# Altium project B100.PrjPcb (part 2 of 7)

## Sheet 3V3 LDO Regulator.SchDoc: 3V3 LDO Regulator
size A4; ApprovedBy: Mehmet Günce Akkoyun; CheckedBy: Mehmet Günce Akkoyun; Author: Mehmet Günce Akkoyun; CompanyName: Ovoo Electronics; DrawnBy: Mehmet Günce Akkoyun; Engineer: Mehmet Günce Akkoyun; Organization: Ovoo Electronics; Address1: Necip Fazıl Mah. Ortaırmak Sok.; Address2: Birgül Apt. No: 19/6; Address3: Meram / Konya; Address4: Turkiye; DocumentNumber: 5; Revision: R06; SheetNumber: 5; SheetTotal: 54
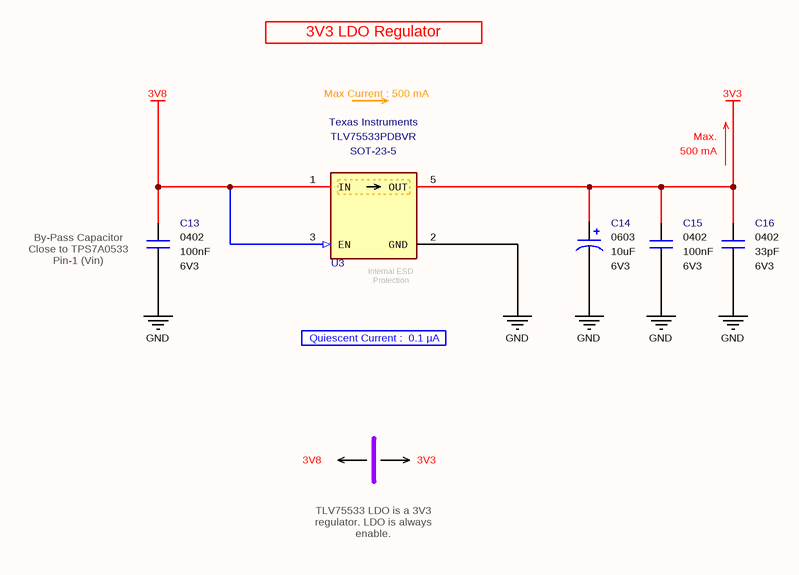
[diagram p6: 3V3 LDO Regulator.SchDoc]

### Parts
C13  value 100nF  Case: 0402  Voltage: 6V3  [CAPACITOR_0402]  (hidden comment: Multilayer Ceramic Capacitor)
C14  value 10uF  Case: 0603  Voltage: 6V3  [CAPACITOR_0603 - TANTALUM]  (hidden comment: Tantalum Capacitor)
C15  value 100nF  Case: 0402  Voltage: 6V3  [CAPACITOR_0402]  (hidden comment: Multilayer Ceramic Capacitor)
C16  value 33pF  Case: 0402  Voltage: 6V3  [CAPACITOR_0402]  (hidden comment: Multilayer Ceramic Capacitor)
U3  Manufacturer Part Number: TLV75533PDBVR  Manufacturer Name: Texas Instruments  [SOT-23-5]  (hidden comment: LDO Voltage Regulator)

### Nets
3V3: C14.1 C15.2 C16.1 U3.5(OUT)
3V8: C13.1 U3.1(IN) U3.3(EN)
GND: C13.2 C14.2 C15.1 C16.2 U3.2(GND)

Not connected (* = marked no-connect by the designer): U3 4(NC)

### Notes on the sheet
- 3V3 LDO Regulator
- Max Current : 500 mA
- Max.
- 500 mA
- (near C13) By-Pass Capacitor
  Close to TPS7A0533
  Pin-1 (Vin)
- Quiescent Current :  0.1 µA
- (near U3) Internal ESD Protection
- 3V8
- 3V3
- TLV75533 LDO is a 3V3 regulator. LDO is always enable.
- Title
- Size:
- Date:
- A4
- Number:
- Time:
- Revision:
- Sheet
- of
- File:

### Library data of the parts
C13 C15 = Capacitor - 100nF [0402-6V3]: Capacitor - 100nF [0402-6V3] (Ceramic); Manufacturer Name: AVX; Manufacturer Part Number: 04026D104KAT4A; Dielectric: X5R; Tolerance: %10; Height: 0.25mm; ComponentLink1Description: Mouser; ComponentLink1URL: https://www.mouser.com.tr/ProductDetail/AVX/04026D104KAT4A?qs=sGAEpiMZZMs0AnBnWHyRQPg4iYkCw7IMED%2F4kpqgf7w%3D; ComponentLink2Description: DataSheet; ComponentLink2URL: https://www.mouser.com.tr/datasheet/2/40/cx5r-776519.pdf; ROHS: Yes; Maximum Operating Temperature: +85; Minimum Operating Temperature: -55; Supplier 1: Avnet; Supplier Part Number 1: 04026D104KAT4A; Mouser Part Number: 581-04026D104KAT4A
C14 = Capacitor - 10uF [0603-6V3] (Tantalium): Capacitor - 10uF [0603] (Tantalium); Manufacturer Name: AVX; Manufacturer Part Number: F380J106MMAAH3; ESR: 200 mOhms; Leakage Current: 10uA; Tolerance: 20%; Height: 0.8mm; Maximum Operating Temperature: +105; Minimum Operating Temperature: -55; ROHS: Yes; ComponentLink1Description: DataSheet; ComponentLink1URL: https://www.mouser.com.tr/datasheet/2/40/f38-775706.pdf; ComponentLink2Description: Mouser; ComponentLink2URL: https://www.mouser.com.tr/ProductDetail/AVX/F380J106MMAAH3?qs=sGAEpiMZZMtZ1n0r9vR22fixilZl6Mr8zRKleESmvcDFwZ4LSyC6Pg%3D%3D; Supplier 1: Mouser; Supplier 2: Digi-Key; Supplier Part Number 2: 478-12031-1-ND; Supplier Part Number 1: 581-F380J106MMAAH3; Mouser Part Number: 581-F380J106MMAAH3
C16 = Capacitor - 33pF [0402-6V3]: as C222 on sheet 3V8 Buck Boost Converter; Height: 0.5mm; Maximum Operating Temperature: +125; Minimum Operating Temperature: -55; ROHS: Yes; ComponentLink1Description: DataSheet; ComponentLink1URL: https://api.kemet.com/component-edge/download/datasheet/C0402C330J9RACAUTO.pdf; ComponentLink2Description: Mouser; ComponentLink2URL: https://www.mouser.com/Search/Refine.aspx?Keyword=80-C0402C330J9RAUTO; Supplier 1: Mouser; Supplier Part Number 1: 80-C0402C330J9RAUTO; Mouser Part Number: 80-C0402C330J9RAUTO
U3 = IC - TLV75533PDBVR: LDO Voltage Regulators 500-mA low-IQ small-size low-dropout (LDO) regulator.; Output Current: 500 mA; Output Voltage: 3.3 V; Dropout Voltage - Max: 220 mV at 500 mA; Height: 1.45mm; ComponentLink1Description: DataSheet; ComponentLink1URL: https://www.ti.com/lit/ds/symlink/tlv755p.pdf?HQS=dis-mous-null-mousermode-dsf-pf-null-wwe&DCM=yes&ref_url=https%3A%2F%2Fwww.mouser.de%2F&distId=26; ComponentLink2Description: Mouser; ComponentLink2URL: https://www.mouser.com.tr/ProductDetail/Texas-Instruments/TLV75533PDBVR/?qs=55YtniHzbhAKEwqeO2xJXQ%3D%3D; Minimum Operating Temperature: -40; Maximum Operating Temperature: +125; Supplier 1: Mouser; Supplier 2: Arrow Electronics; Supplier 3: Digi-Key; Supplier 4: Digi-Key; Supplier 5: Digi-Key; Supplier 6: Avnet; Supplier Part Number 1: 595-TLV75533PDBVR; Supplier Part Number 2: TLV75533PDBVR; Supplier Part Number 3: 296-50411-1-ND; Supplier Part Number 4: 296-50411-6-ND; Supplier Part Number 5: 296-50411-2-ND; Supplier Part Number 6: TLV75533PDBVR; Case: SOT-23-5; Mouser Part Number: 595-TLV75533PDBVR

## Sheet GSM IoT.SchDoc: GSM IoT Block Diagram
size A3; ApprovedBy: Mehmet Günce Akkoyun; CheckedBy: Mehmet Günce Akkoyun; Author: Mehmet Günce Akkoyun; CompanyName: Ovoo Electronics; DrawnBy: Mehmet Günce Akkoyun; Engineer: Mehmet Günce Akkoyun; Organization: Ovoo Electronics; Address1: Necip Fazıl Mah. Ortaırmak Sok.; Address2: Birgül Apt. No: 19/6; Address3: Meram / Konya; Address4: Turkiye; DocumentNumber: 8; Revision: R06; SheetNumber: 8; SheetTotal: 54
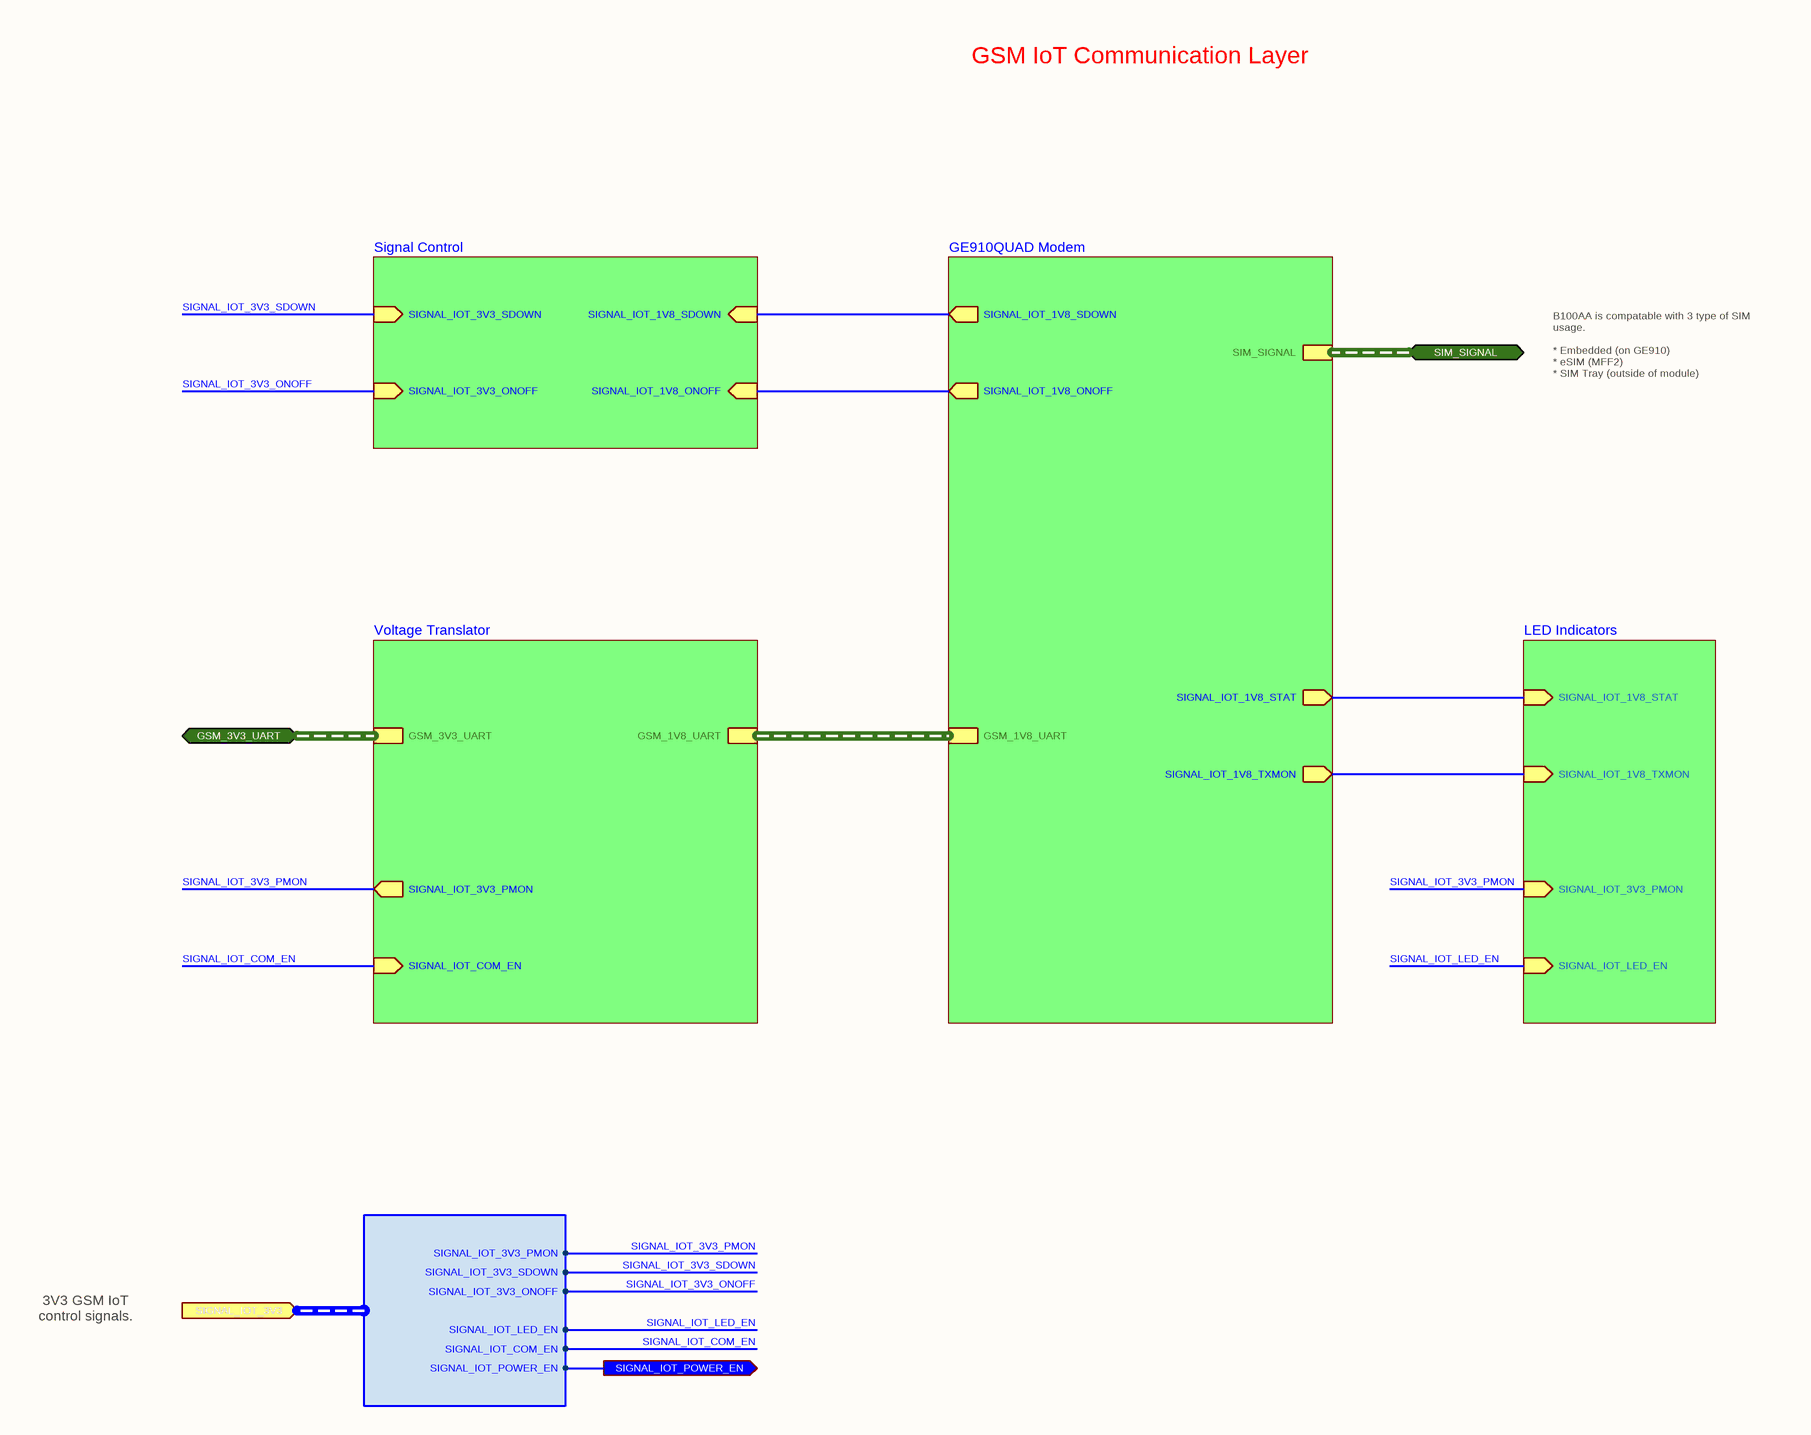
[diagram p7: GSM IoT.SchDoc]

### Sub-sheets
GE910QUAD Modem = GE910QUAD Modem.SchDoc: SIGNAL_IOT_1V8_STAT (out), SIGNAL_IOT_1V8_TXMON (out), SIGNAL_IOT_1V8_ONOFF (out), GSM_1V8_UART (harness GSM_1V8_UART), SIGNAL_IOT_1V8_SDOWN (out), SIM_SIGNAL (harness SIM_SIGNAL)
LED Indicators = GSM LED Indicators.SchDoc: SIGNAL_IOT_3V3_PMON (in), SIGNAL_IOT_1V8_STAT (in), SIGNAL_IOT_LED_EN (in), SIGNAL_IOT_1V8_TXMON (in)
Signal Control = GSM Signal Control.SchDoc: SIGNAL_IOT_3V3_SDOWN (in), SIGNAL_IOT_3V3_ONOFF (in), SIGNAL_IOT_1V8_SDOWN (in), SIGNAL_IOT_1V8_ONOFF (in)
Voltage Translator = Bidirectional Voltage Translator.SchDoc: GSM_3V3_UART (harness GSM_3V3_UART), SIGNAL_IOT_COM_EN (in), GSM_1V8_UART (harness GSM_1V8_UART), SIGNAL_IOT_3V3_PMON (out)

### Ports
GSM_3V3_UART (bidir, harness GSM_3V3_UART), SIGNAL_IOT_3V3 (in, harness SIGNAL_IOT_3V3), SIGNAL_IOT_POWER_EN (out), SIM_SIGNAL (bidir, harness SIM_SIGNAL)

### Harnesses
SIGNAL_IOT_3V3: SIGNAL_IOT_COM_EN, SIGNAL_IOT_POWER_EN, SIGNAL_IOT_LED_EN, SIGNAL_IOT_3V3_SDOWN, SIGNAL_IOT_3V3_ONOFF, SIGNAL_IOT_3V3_PMON

### Nets
SIGNAL_IOT_3V3.SIGNAL_IOT_POWER_EN: port SIGNAL_IOT_POWER_EN, port SIGNAL_IOT_3V3.SIGNAL_IOT_POWER_EN
SIGNAL_IOT_3V3_ONOFF: sheet Signal Control/SIGNAL_IOT_3V3_ONOFF, port SIGNAL_IOT_3V3.SIGNAL_IOT_3V3_ONOFF  [project net SIGNAL_IOT_3V3.SIGNAL_IOT_3V3_ONOFF]
SIGNAL_IOT_3V3_PMON: sheet Voltage Translator/SIGNAL_IOT_3V3_PMON, sheet LED Indicators/SIGNAL_IOT_3V3_PMON, port SIGNAL_IOT_3V3.SIGNAL_IOT_3V3_PMON  [project net SIGNAL_IOT_3V3.SIGNAL_IOT_3V3_PMON]
SIGNAL_IOT_3V3_SDOWN: sheet Signal Control/SIGNAL_IOT_3V3_SDOWN, port SIGNAL_IOT_3V3.SIGNAL_IOT_3V3_SDOWN  [project net SIGNAL_IOT_3V3.SIGNAL_IOT_3V3_SDOWN]
SIGNAL_IOT_COM_EN: sheet Voltage Translator/SIGNAL_IOT_COM_EN, port SIGNAL_IOT_3V3.SIGNAL_IOT_COM_EN  [project net SIGNAL_IOT_3V3.SIGNAL_IOT_COM_EN]
SIGNAL_IOT_LED_EN: sheet LED Indicators/SIGNAL_IOT_LED_EN, port SIGNAL_IOT_3V3.SIGNAL_IOT_LED_EN  [project net SIGNAL_IOT_3V3.SIGNAL_IOT_LED_EN]
NetQ1_3: sheet GE910QUAD Modem/SIGNAL_IOT_1V8_ONOFF, sheet Signal Control/SIGNAL_IOT_1V8_ONOFF
NetQ2_3: sheet GE910QUAD Modem/SIGNAL_IOT_1V8_SDOWN, sheet Signal Control/SIGNAL_IOT_1V8_SDOWN
NetR23_2: sheet GE910QUAD Modem/SIGNAL_IOT_1V8_STAT, sheet LED Indicators/SIGNAL_IOT_1V8_STAT
NetR24_2: sheet GE910QUAD Modem/SIGNAL_IOT_1V8_TXMON, sheet LED Indicators/SIGNAL_IOT_1V8_TXMON

### Buses and harness runs
harness port GSM_3V3_UART = sheet Voltage Translator/GSM_3V3_UART
harness port SIM_SIGNAL = sheet GE910QUAD Modem/SIM_SIGNAL
harness sheet GE910QUAD Modem/GSM_1V8_UART = sheet Voltage Translator/GSM_1V8_UART

### Notes on the sheet
- GSM IoT Communication Layer
- B100AA is compatable with 3 type of SIM usage.
  * Embedded (on GE910)
  * eSIM (MFF2)
  * SIM Tray (outside of module)
  One of these SIM type is used.
- 3V3 GSM IoT control signals.
- Title
- Size:
- Date:
- A3
- Number:
- Time:
- Revision:
- Sheet
- of
- File:

## Sheet GE910QUAD Modem.SchDoc: GE910 GSM Modem & SIM
size A3; ApprovedBy: Mehmet Günce Akkoyun; CheckedBy: Mehmet Günce Akkoyun; Author: Mehmet Günce Akkoyun; CompanyName: Ovoo Electronics; DrawnBy: Mehmet Günce Akkoyun; Engineer: Mehmet Günce Akkoyun; Organization: Ovoo Electronics; Address1: Necip Fazıl Mah. Ortaırmak Sok.; Address2: Birgül Apt. No: 19/6; Address3: Meram / Konya; Address4: Turkiye; DocumentNumber: 9; Revision: R06; SheetNumber: 9; SheetTotal: 54
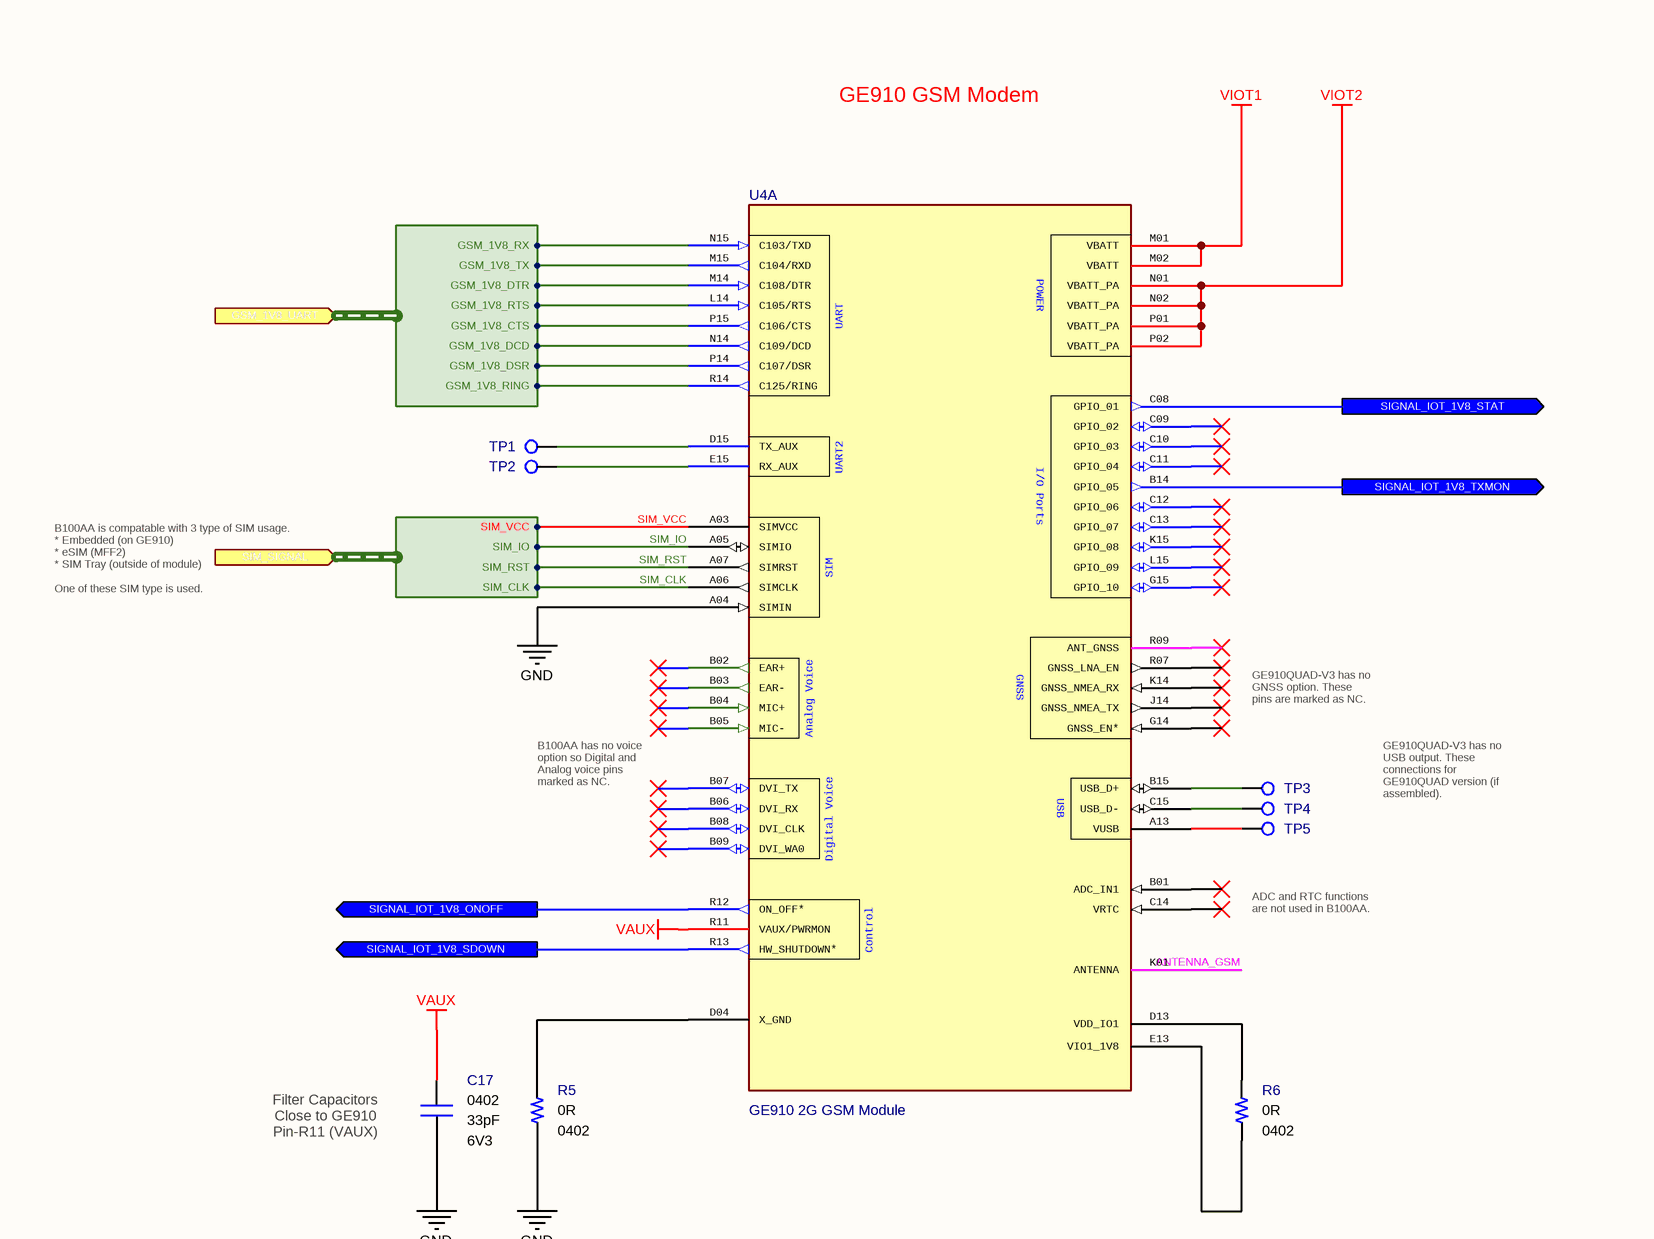
[diagram p8: GE910QUAD Modem.SchDoc, top left]
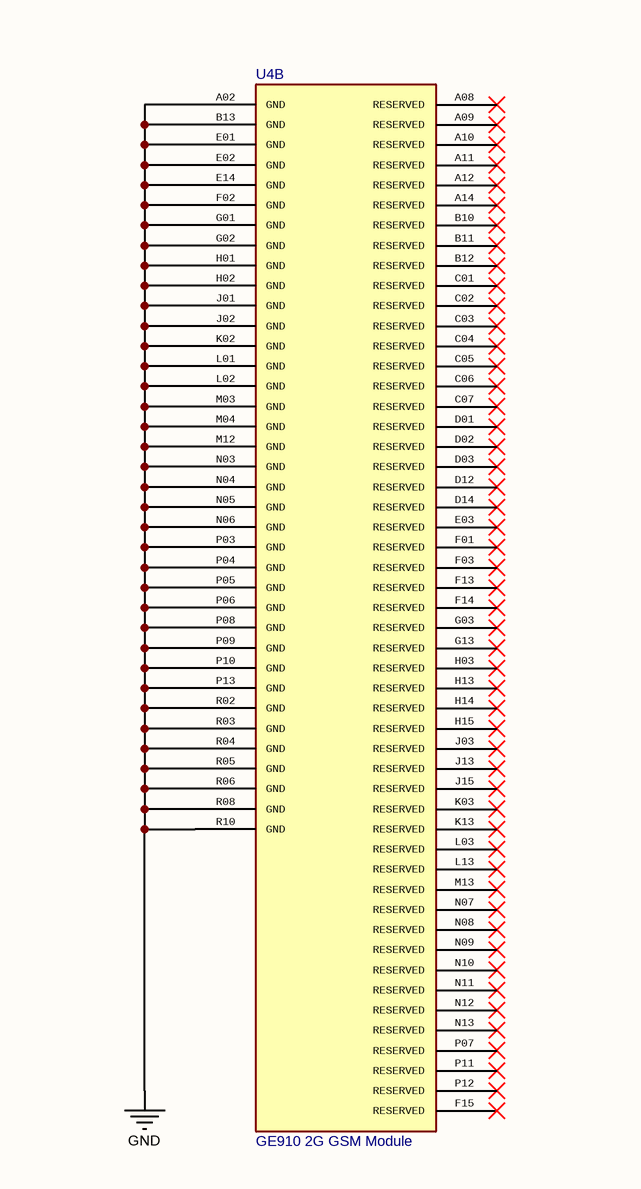
[diagram p9: GE910QUAD Modem.SchDoc, top right]
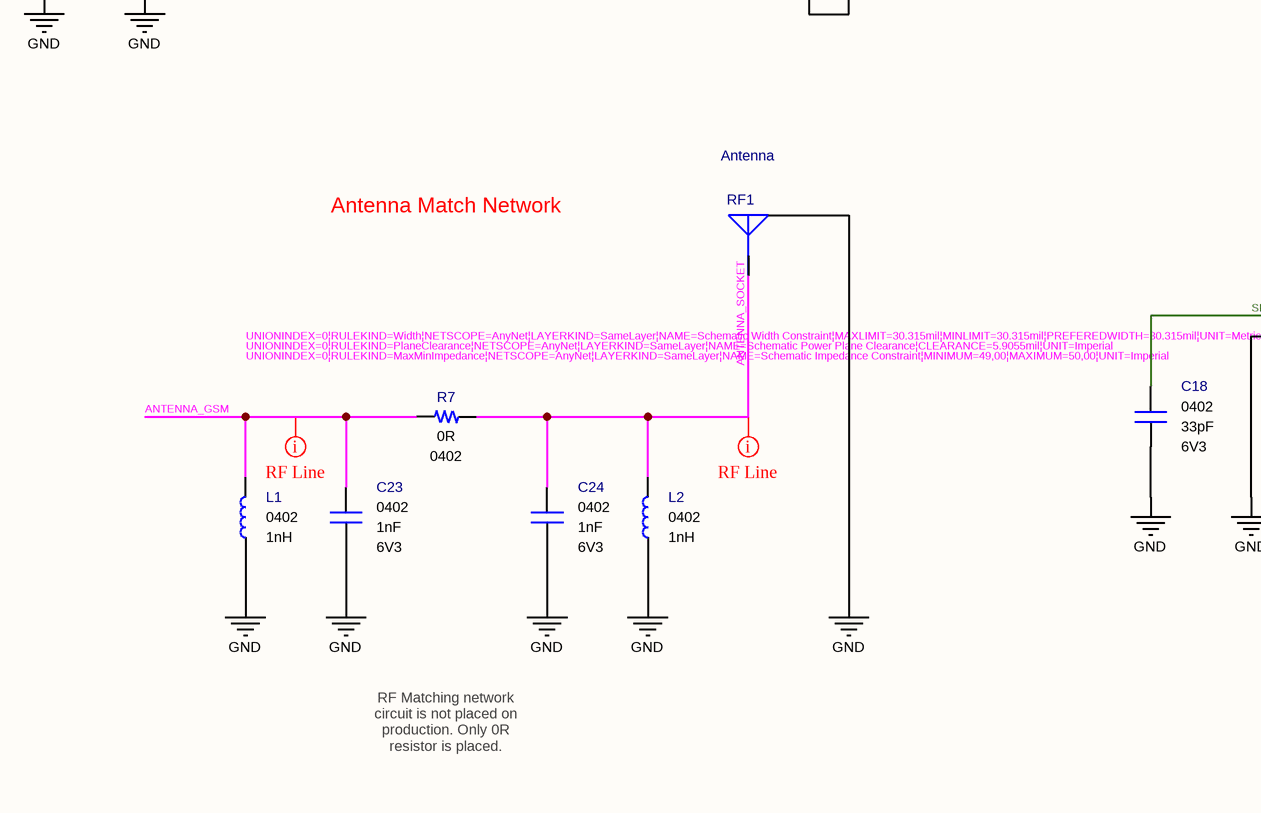
[diagram p10: GE910QUAD Modem.SchDoc, bottom left]
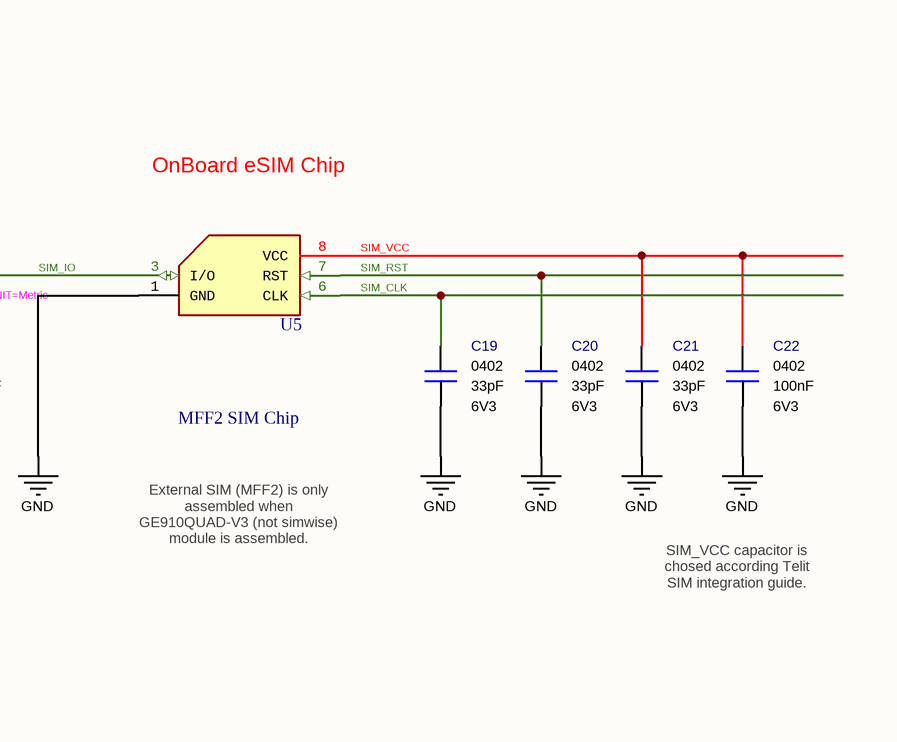
[diagram p11: GE910QUAD Modem.SchDoc, bottom right]

### Parts
C17  value 33pF  Case: 0402  Voltage: 6V3  [CAPACITOR_0402]  (hidden comment: Multilayer Ceramic Capacitor)
C18  value 33pF  Case: 0402  Voltage: 6V3  [CAPACITOR_0402]  (hidden comment: Multilayer Ceramic Capacitor)
C19  value 33pF  Case: 0402  Voltage: 6V3  [CAPACITOR_0402]  (hidden comment: Multilayer Ceramic Capacitor)
C20  value 33pF  Case: 0402  Voltage: 6V3  [CAPACITOR_0402]  (hidden comment: Multilayer Ceramic Capacitor)
C21  value 33pF  Case: 0402  Voltage: 6V3  [CAPACITOR_0402]  (hidden comment: Multilayer Ceramic Capacitor)
C22  value 100nF  Case: 0402  Voltage: 6V3  [CAPACITOR_0402]  (hidden comment: Multilayer Ceramic Capacitor)
C23  value 1nF  Case: 0402  Voltage: 6V3  [CAPACITOR_0402]  (hidden comment: Multilayer Ceramic Capacitor)
C24  value 1nF  Case: 0402  Voltage: 6V3  [CAPACITOR_0402]  (hidden comment: Multilayer Ceramic Capacitor)
L1  value 1nH  Case: 0402  [INDUCTOR_0402]  (hidden comment: Fixed Inductor)
L2  value 1nH  Case: 0402  [INDUCTOR_0402]  (hidden comment: Fixed Inductor)
R5  value 0R  Case: 0402  [RESISTOR_0402]  (hidden comment: Thick Film Resistor)
R6  value 0R  Case: 0402  [RESISTOR_0402]  (hidden comment: Thick Film Resistor)
R7  value 0R  Case: 0402  [RESISTOR_0402]  (hidden comment: Thick Film Resistor)
RF1  Antenna  [Connector_IPEX]
TP1  PCB - Test Point  [Test_Point]  (value not drawn)  (no BOM)
TP2  PCB - Test Point  [Test_Point]  (value not drawn)  (no BOM)
TP3  PCB - Test Point  [Test_Point]  (value not drawn)  (no BOM)
TP4  PCB - Test Point  [Test_Point]  (value not drawn)  (no BOM)
TP5  PCB - Test Point  [Test_Point]  (value not drawn)  (no BOM)
U4  GE910 2G GSM Module  [GE910 2G GSM Modem]  (parts A,B of 2)
U5  MFF2 SIM Chip  [MFF2]

### Ports
GSM_1V8_UART (in, harness GSM_1V8_UART), SIGNAL_IOT_1V8_ONOFF (out), SIGNAL_IOT_1V8_SDOWN (out), SIGNAL_IOT_1V8_STAT (out), SIGNAL_IOT_1V8_TXMON (out), SIM_SIGNAL (in, harness SIM_SIGNAL)

### Harnesses
GSM_1V8_UART: GSM_1V8_RX, GSM_1V8_TX, GSM_1V8_DTR, GSM_1V8_RTS, GSM_1V8_CTS, GSM_1V8_DCD, GSM_1V8_DSR, GSM_1V8_RING
SIM_SIGNAL: SIM_VCC, SIM_IO, SIM_RST, SIM_CLK

### Nets
GND: C17.1 C18.1 C19.1 C20.1 C21.1 C22.1 C23.1 C24.1 L1.1 L2.1 R5.1 RF1.2(GND) U4.A02(GND) U4.A04(SIMIN) U4.B13(GND) U4.E01(GND) U4.E02(GND) U4.E14(GND) U4.F02(GND) U4.G01(GND) U4.G02(GND) U4.H01(GND) U4.H02(GND) U4.J01(GND) U4.J02(GND) U4.K02(GND) U4.L01(GND) U4.L02(GND) U4.M03(GND) U4.M04(GND) U4.M12(GND) U4.N03(GND) U4.N04(GND) U4.N05(GND) U4.N06(GND) U4.P03(GND) U4.P04(GND) U4.P05(GND) U4.P06(GND) U4.P08(GND) U4.P09(GND) U4.P10(GND) U4.P13(GND) U4.R02(GND) U4.R03(GND) U4.R04(GND) U4.R05(GND) U4.R06(GND) U4.R08(GND) U4.R10(GND) U5.1(GND)
VAUX: C17.2 U4.R11(VAUX/PWRMON)
VIOT1: U4.M01(VBATT) U4.M02(VBATT)
VIOT2: U4.N01(VBATT_PA) U4.N02(VBATT_PA) U4.P01(VBATT_PA) U4.P02(VBATT_PA)
ANTENNA_GSM: C23.2 L1.2 R7.2 U4.K01(ANTENNA)
ANTENNA_SOCKET: C24.2 L2.2 R7.1 RF1.1(Signal)
SIM_CLK: C19.2 U4.A06(SIMCLK) U5.6(CLK) ; port SIM_SIGNAL.SIM_CLK
SIM_IO: C18.2 U4.A05(SIMIO) U5.3(I/O) ; port SIM_SIGNAL.SIM_IO
SIM_RST: C20.2 U4.A07(SIMRST) U5.7(RST) ; port SIM_SIGNAL.SIM_RST
SIM_VCC: C21.2 C22.2 U4.A03(SIMVCC) U5.8(VCC) ; port SIM_SIGNAL.SIM_VCC
NetC32_2: U4.R14(C125/RING) ; port GSM_1V8_UART.GSM_1V8_RING
NetC39_2: U4.P14(C107/DSR) ; port GSM_1V8_UART.GSM_1V8_DSR
NetC40_2: U4.N14(C109/DCD) ; port GSM_1V8_UART.GSM_1V8_DCD
NetC41_2: U4.L14(C105/RTS) ; port GSM_1V8_UART.GSM_1V8_RTS
NetC49_2: U4.P15(C106/CTS) ; port GSM_1V8_UART.GSM_1V8_CTS
NetC50_2: U4.M15(C104/RXD) ; port GSM_1V8_UART.GSM_1V8_TX
NetC51_2: U4.N15(C103/TXD) ; port GSM_1V8_UART.GSM_1V8_RX
NetC52_2: U4.M14(C108/DTR) ; port GSM_1V8_UART.GSM_1V8_DTR
NetQ1_3: U4.R12(ON_OFF*) ; port SIGNAL_IOT_1V8_ONOFF
NetQ2_3: U4.R13(HW_SHUTDOWN*) ; port SIGNAL_IOT_1V8_SDOWN
NetR5_2: R5.2 U4.D04(X_GND)
NetR6_1: R6.1 U4.E13(VIO1_1V8)
NetR6_2: R6.2 U4.D13(VDD_IO1)
NetR23_2: U4.C08(GPIO_01) ; port SIGNAL_IOT_1V8_STAT
NetR24_2: U4.B14(GPIO_05) ; port SIGNAL_IOT_1V8_TXMON
NetTP1_1: TP1.1 U4.D15(TX_AUX)
NetTP2_1: TP2.1 U4.E15(RX_AUX)
NetTP3_1: TP3.1 U4.B15(USB_D+)
NetTP4_1: TP4.1 U4.C15(USB_D-)
NetTP5_1: TP5.1 U4.A13(VUSB)

Not connected (* = marked no-connect by the designer): U4 A08(RESERVED)* A09(RESERVED)* A10(RESERVED)* A11(RESERVED)* A12(RESERVED)* A14(RESERVED)* B01(ADC_IN1)* B02(EAR+)* B03(EAR-)* B04(MIC+)* B05(MIC-)* B06(DVI_RX)* B07(DVI_TX)* B08(DVI_CLK)* B09(DVI_WA0)* B10(RESERVED)* B11(RESERVED)* B12(RESERVED)* C01(RESERVED)* C02(RESERVED)* C03(RESERVED)* C04(RESERVED)* C05(RESERVED)* C06(RESERVED)* C07(RESERVED)* C09(GPIO_02)* C10(GPIO_03)* C11(GPIO_04)* C12(GPIO_06)* C13(GPIO_07)* C14(VRTC)* D01(RESERVED)* D02(RESERVED)* D03(RESERVED)* D12(RESERVED)* D14(RESERVED)* E03(RESERVED)* F01(RESERVED)* F03(RESERVED)* F13(RESERVED)* F14(RESERVED)* F15(RESERVED)* G03(RESERVED)* G13(RESERVED)* G14(GNSS_EN*)* G15(GPIO_10)* H03(RESERVED)* H13(RESERVED)* H14(RESERVED)* H15(RESERVED)* J03(RESERVED)* J13(RESERVED)* J14(GNSS_NMEA_TX)* J15(RESERVED)* K03(RESERVED)* K13(RESERVED)* K14(GNSS_NMEA_RX)* K15(GPIO_08)* L03(RESERVED)* L13(RESERVED)* L15(GPIO_09)* M13(RESERVED)* N07(RESERVED)* N08(RESERVED)* N09(RESERVED)* N10(RESERVED)* N11(RESERVED)* N12(RESERVED)* N13(RESERVED)* P07(RESERVED)* P11(RESERVED)* P12(RESERVED)* R07(GNSS_LNA_EN)* R09(ANT_GNSS)*; U5 2(NC) 4(NC) 5(NC)

### Layout directives
rule Impedance Constraint [Min = 49.00    Max = 50.00    ]; rule Power Plane Clearance [Clearance = 5.906mil]; rule Width Constraint [Pref Width = 0.77mm    Min Width = 0.77mm    Max Width = 0.77mm]: ANTENNA_GSM, ANTENNA_SOCKET

### Notes on the sheet
- GE910 GSM Modem
- B100AA is compatable with 3 type of SIM usage.
  * Embedded (on GE910)
  * eSIM (MFF2)
  * SIM Tray (outside of module)
  One of these SIM type is used.
- GE910QUAD-V3 has no GNSS option. These pins are marked as NC.
- B100AA has no voice option so Digital and Analog voice pins marked as NC.
- GE910QUAD-V3 has no USB output. These connections for GE910QUAD version (if assembled).
- ADC and RTC functions are not used in B100AA.
- (near C17) Filter Capacitors
  Close to GE910
  Pin-R11 (VAUX)
- Antenna Match Network
- (near U5) OnBoard eSIM Chip
- External SIM (MFF2) is only assembled when GE910QUAD-V3 (not simwise) module is assembled.
- SIM_VCC capacitor is chosed according Telit SIM integration guide.
- RF Matching network circuit is not placed on production. Only 0R resistor is placed.
- Title
- Size:
- Date:
- A3
- Number:
- Time:
- Revision:
- Sheet
- of
- File:
- (in symbol IC - Telit GE910QUAD, part A) POWER; UART; UART2; I/O Ports; SIM; GNSS; Analog Voice; USB; Digital Voice; Control

### Library data of the parts
C17-C21 = Capacitor - 33pF [0402-6V3]: as C222 on sheet 3V8 Buck Boost Converter; Height: 0.5mm; Maximum Operating Temperature: +125; Minimum Operating Temperature: -55; ROHS: Yes; ComponentLink1Description: DataSheet; ComponentLink1URL: https://api.kemet.com/component-edge/download/datasheet/C0402C330J9RACAUTO.pdf; ComponentLink2Description: Mouser; ComponentLink2URL: https://www.mouser.com/Search/Refine.aspx?Keyword=80-C0402C330J9RAUTO; Supplier 1: Mouser; Supplier Part Number 1: 80-C0402C330J9RAUTO; Mouser Part Number: 80-C0402C330J9RAUTO
C22 = Capacitor - 100nF [0402-6V3]: as C13 on sheet 3V3 LDO Regulator; Height: 0.25mm; ComponentLink1Description: Mouser; ComponentLink1URL: https://www.mouser.com.tr/ProductDetail/AVX/04026D104KAT4A?qs=sGAEpiMZZMs0AnBnWHyRQPg4iYkCw7IMED%2F4kpqgf7w%3D; ComponentLink2Description: DataSheet; ComponentLink2URL: https://www.mouser.com.tr/datasheet/2/40/cx5r-776519.pdf; ROHS: Yes; Maximum Operating Temperature: +85; Minimum Operating Temperature: -55; Supplier 1: Avnet; Supplier Part Number 1: 04026D104KAT4A; Mouser Part Number: 581-04026D104KAT4A
C23 C24 = Capacitor - 1nF [0402-6V3]: Capacitor - 1nF [0402] (Ceramic); Manufacturer Name: AVX; Manufacturer Part Number: 04026C102MAT2A; Dielectric: X7R; Tolerance: 20%; Height: 0.25mm; Mouser Price/Stock: 0.074; Maximum Operating Temperature: +125; Minimum Operating Temperature: -55; ROHS: Yes; Weight: 0.65mg; ComponentLink1Description: DataSheet; ComponentLink1URL: https://www.mouser.com.tr/datasheet/2/40/X7RDielectric-777024.pdf; Supplier 1: Mouser; Supplier Part Number 1: 581-04026C102MAT2A; Mouser Part Number: 581-04026C102MAT2A; ComponentLink2Description: Mouser; ComponentLink2URL: https://www.mouser.com.tr/ProductDetail/AVX/04026C102MAT2A/?qs=%2Fha2pyFaduih52wBA08yQb8Fl0MEN8ljDrRW0UuYpjAzFvrGZxsBOQ%3D%3D
L1 L2 = Inductor - 1nH [0402]: Manufacturer Name: Murata Electronics; Manufacturer Part Number: LQG15HN1N0S02D; Tolerance: 0.3 nH; Height: 0.35mm; ComponentLink1Description: DataSheet; ComponentLink1URL: https://www.mouser.com.tr/datasheet/2/281/JELF243B-0009-1699631.pdf; ComponentLink2Description: Mouser; ComponentLink2URL: https://www.mouser.com.tr/ProductDetail/Murata-Electronics/LQG15HN1N0S02D?qs=sGAEpiMZZMsg%252By3WlYCkUySk0uOsB1dTfJeMbA4C8Pk%3D; Supplier 1: Future Electronics; Supplier 2: Future Electronics; Supplier 3: Mouser; Supplier 4: Arrow; Supplier 5: Digi-Key; Supplier Part Number 1: LQG15HN1N0S02D-CUTT; Supplier Part Number 2: LQG15HN1N0S02D-REEL; Supplier Part Number 3: 81-LQG15HN1N0S02D; Supplier Part Number 4: LQG15HN1N0S02D; Supplier Part Number 5: 490-1073-1-ND; Mouser Part Number: 81-LQG15HN1N0S02D
R5-R7 = Resistor - 0R: Thick Film Resistors - SMD 1/16 W 0 Ohms; Manufacturer Name: Vishay; Manufacturer Part Number: CRCW04020000Z0ED; Height: 0.4mm; ComponentLink1Description: DataSheet; ComponentLink1URL: https://www.mouser.com.tr/datasheet/2/427/dcrcwe3-1762152.pdf; ComponentLink2Description: Mouser; ComponentLink2URL: https://www.mouser.com.tr/ProductDetail/Vishay-Dale/CRCW04020000Z0ED?qs=sGAEpiMZZMu61qfTUdNhG2DpbjADlD3GG34cJb50zyg%3D; Supplier 1: Mouser; Supplier 2: Digi-Key; Supplier Part Number 1: 71-CRCW0402-0-E3; Supplier Part Number 2: 541-0.0JCT-ND; Mouser Part Number: 71-CRCW0402-0-E3
RF1 = Connector - MHF: MHF Antenna Socket; ROHS: Yes; Supplier 1: Mouser; Supplier 2: Arrow; Supplier Part Number 1: 200-RSP-122811-01; Supplier Part Number 2: RSP-122811-01; Case: SMD
TP1-TP5 = PCB - Test Point: Test Point
U4 = IC - Telit GE910QUAD: Telit GE910 GPRS/UMTS Module; ComponentLink1Description: Product Page; ComponentLink1URL: https://www.telit.com/product-series/ge910/; Manufacturer Name: Telit; Manufacturer Part Number: GE910QUAD; Case: BGA
U5 = IC - MFF2: SIM Chip MFF2

## Sheet GSM Signal Control.SchDoc: GSM Control Signal Management
size A4; ApprovedBy: Mehmet Günce Akkoyun; CheckedBy: Mehmet Günce Akkoyun; CompanyName: Ovoo Electronics; DrawnBy: Mehmet Günce Akkoyun; Engineer: Mehmet Günce Akkoyun; Organization: Ovoo Electronics; Address1: Necip Fazıl Mah. Ortaırmak Sok.; Address2: Birgül Apt. No: 19/6; Address3: Meram / Konya; Address4: Turkiye; DocumentNumber: 10; Revision: R06; SheetNumber: 10; SheetTotal: 54
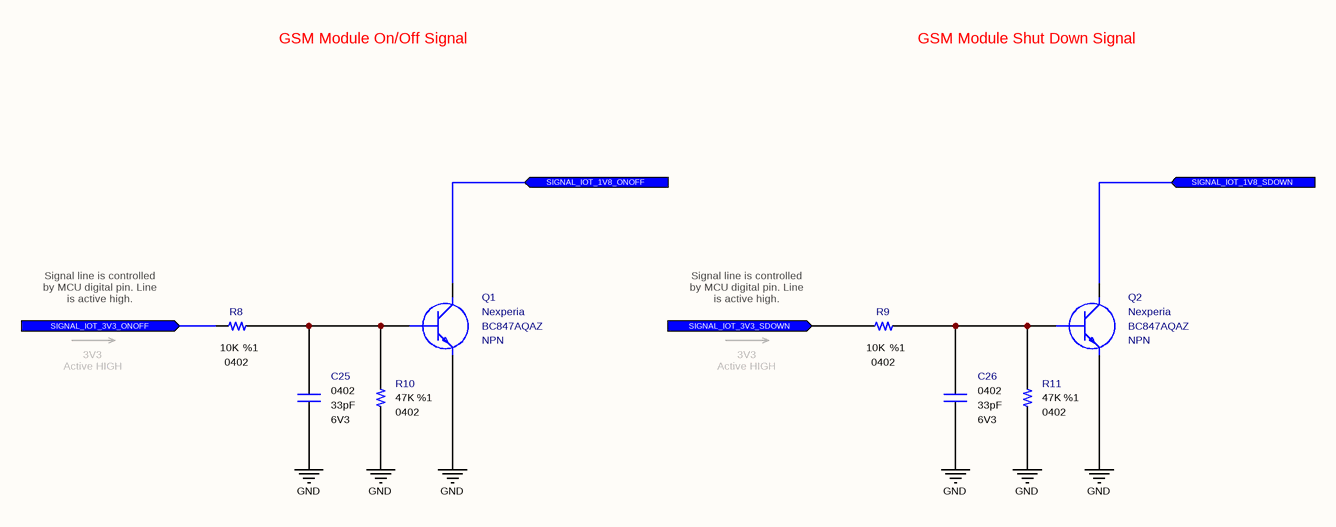
[diagram p12: GSM Signal Control.SchDoc]

### Parts
C25  value 33pF  Case: 0402  Voltage: 6V3  [CAPACITOR_0402]  (hidden comment: Multilayer Ceramic Capacitor)
C26  value 33pF  Case: 0402  Voltage: 6V3  [CAPACITOR_0402]  (hidden comment: Multilayer Ceramic Capacitor)
Q1  Manufacturer_Name: Nexperia  Manufacturer_Part_Number: BC847AQAZ  Polarity: NPN  [SOT1215]  (hidden comment: Bipolar NPN Transistors)
Q2  Manufacturer_Name: Nexperia  Manufacturer_Part_Number: BC847AQAZ  Polarity: NPN  [SOT1215]  (hidden comment: Bipolar NPN Transistors)
R8  value 10K  Tolerance: %1  Case: 0402  [RESISTOR_0402]  (hidden comment: Thick Film Resistor)
R9  value 10K  Tolerance: %1  Case: 0402  [RESISTOR_0402]  (hidden comment: Thick Film Resistor)
R10  value 47K  Tolerance: %1  Case: 0402  [RESISTOR_0402]  (hidden comment: Thick Film Resistor)
R11  value 47K  Tolerance: %1  Case: 0402  [RESISTOR_0402]  (hidden comment: Thick Film Resistor)

### Ports
SIGNAL_IOT_1V8_ONOFF (in), SIGNAL_IOT_1V8_SDOWN (in), SIGNAL_IOT_3V3_ONOFF (in), SIGNAL_IOT_3V3_SDOWN (in)

### Nets
GND: C25.2 C26.2 Q1.2(E) Q2.2(E) R10.1 R11.1
SIGNAL_IOT_3V3.SIGNAL_IOT_3V3_ONOFF: R8.2 ; port SIGNAL_IOT_3V3_ONOFF
SIGNAL_IOT_3V3.SIGNAL_IOT_3V3_SDOWN: R9.2 ; port SIGNAL_IOT_3V3_SDOWN
NetC25_1: C25.1 Q1.1(B) R8.1 R10.2
NetC26_1: C26.1 Q2.1(B) R9.1 R11.2
NetQ1_3: Q1.3(C) ; port SIGNAL_IOT_1V8_ONOFF
NetQ2_3: Q2.3(C) ; port SIGNAL_IOT_1V8_SDOWN

### Notes on the sheet
- GSM Module On/Off Signal
- GSM Module Shut Down Signal
- Signal line is controlled by MCU digital pin. Line is active high.
- 3V3
  Active HIGH
- Engineer
- All Rights are reserved to Customer and Engineer. [2021]
- Size:
- Date:
- A4
- Project :
- Time:
- Sheet
- of
- Customer
- Product ID
- Module ID
- Version
- File:
- Revision

### Library data of the parts
C25 C26 = Capacitor - 33pF [0402-6V3]: as C222 on sheet 3V8 Buck Boost Converter; Height: 0.5mm; Maximum Operating Temperature: +125; Minimum Operating Temperature: -55; ROHS: Yes; ComponentLink1Description: DataSheet; ComponentLink1URL: https://api.kemet.com/component-edge/download/datasheet/C0402C330J9RACAUTO.pdf; ComponentLink2Description: Mouser; ComponentLink2URL: https://www.mouser.com/Search/Refine.aspx?Keyword=80-C0402C330J9RAUTO; Supplier 1: Mouser; Supplier Part Number 1: 80-C0402C330J9RAUTO; Mouser Part Number: 80-C0402C330J9RAUTO
Q1 Q2 = Transistor - BC847: Bipolar Transistors - BJT BC847AQA/DFN1010D-3/REEL 7" Q2; Mouser_Part_Number: 771-BC847AQAZ; ComponentLink1Description: DataSheet; ComponentLink1URL: https://www.mouser.com.tr/datasheet/2/916/BC847XQA_SER-1598405.pdf; ComponentLink2Description: Mouser; ComponentLink2URL: https://www.mouser.com.tr/ProductDetail/Nexperia/BC847AQAZ?qs=%2Fha2pyFaduhKMCPKNtQimeJpXTw9z4AqURd2YARs8DVICZNv3AT9Dw%3D%3D; Case: DFN-1010D-3; Supplier 1: Mouser; Supplier 2: Digi-Key; Supplier Part Number 1: 771-BC847AQAZ; Supplier Part Number 2: 1727-2545-1-ND
R8 R9 = Resistor - 10K: Thick Film Resistors - SMD 1/16 W 10 Kohms 1%; Manufacturer Name: Vishay; Manufacturer Part Number: CRCW040210K0FKED; Height: 0.4mm; ComponentLink1Description: DataSheet; ComponentLink1URL: https://www.mouser.com.tr/datasheet/2/427/dcrcwe3-1762152.pdf; ComponentLink2Description: Mouser; ComponentLink2URL: https://www.mouser.com.tr/ProductDetail/Vishay-Dale/CRCW040210K0FKED?qs=sGAEpiMZZMu61qfTUdNhG2DpbjADlD3GcalbOv9utCY%3D; Supplier 1: Mouser; Supplier 2: Digi-Key; Supplier Part Number 1: 71-CRCW040210K0FKEDH; Supplier Part Number 2: 541-10.0KYCT-ND; Mouser Part Number: 71-CRCW0402-10K-E3
R10 R11 = Resistor - 47K: as R69 on sheet 5V Buck Boost Converter; Height: 0.4mm; ComponentLink1Description: DataSheet; ComponentLink1URL: https://www.mouser.com.tr/datasheet/2/427/dcrcwe3-1762152.pdf; ComponentLink2Description: Mouser; ComponentLink2URL: https://www.mouser.com.tr/ProductDetail/Vishay-Dale/CRCW040247K0FKED?qs=sGAEpiMZZMu61qfTUdNhG2DpbjADlD3GL%252B3h1elTxqU%3D; Supplier 1: Mouser; Supplier 2: Digi-Key; Supplier Part Number 1: 71-CRCW040247K0FKEDH; Supplier Part Number 2: 541-47.0KYCT-ND; Mouser Part Number: 71-CRCW0402-47K-E3

## Sheet Bidirectional Voltage Translator.SchDoc: 3V3 - 1V8 Voltage Level Translator
size A2; ApprovedBy: Mehmet Günce Akkoyun; CheckedBy: Mehmet Günce Akkoyun; Author: Mehmet Günce Akkoyun; CompanyName: Ovoo Electronics; DrawnBy: Mehmet Günce Akkoyun; Engineer: Mehmet Günce Akkoyun; Organization: Ovoo Electronics; Address1: Necip Fazıl Mah. Ortaırmak Sok.; Address2: Birgül Apt. No: 19/6; Address3: Meram / Konya; Address4: Turkiye; DocumentNumber: 11; Revision: R06; SheetNumber: 11; SheetTotal: 54
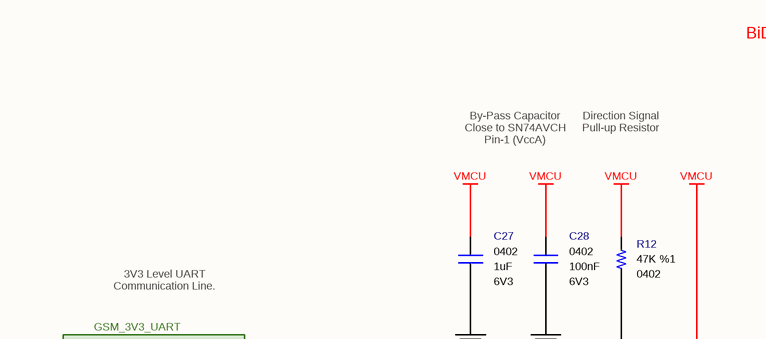
[diagram p13: Bidirectional Voltage Translator.SchDoc, top left]
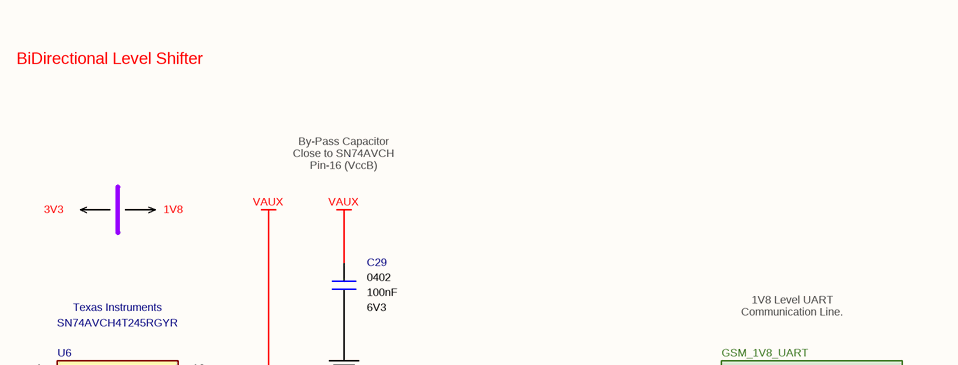
[diagram p14: Bidirectional Voltage Translator.SchDoc, top right]
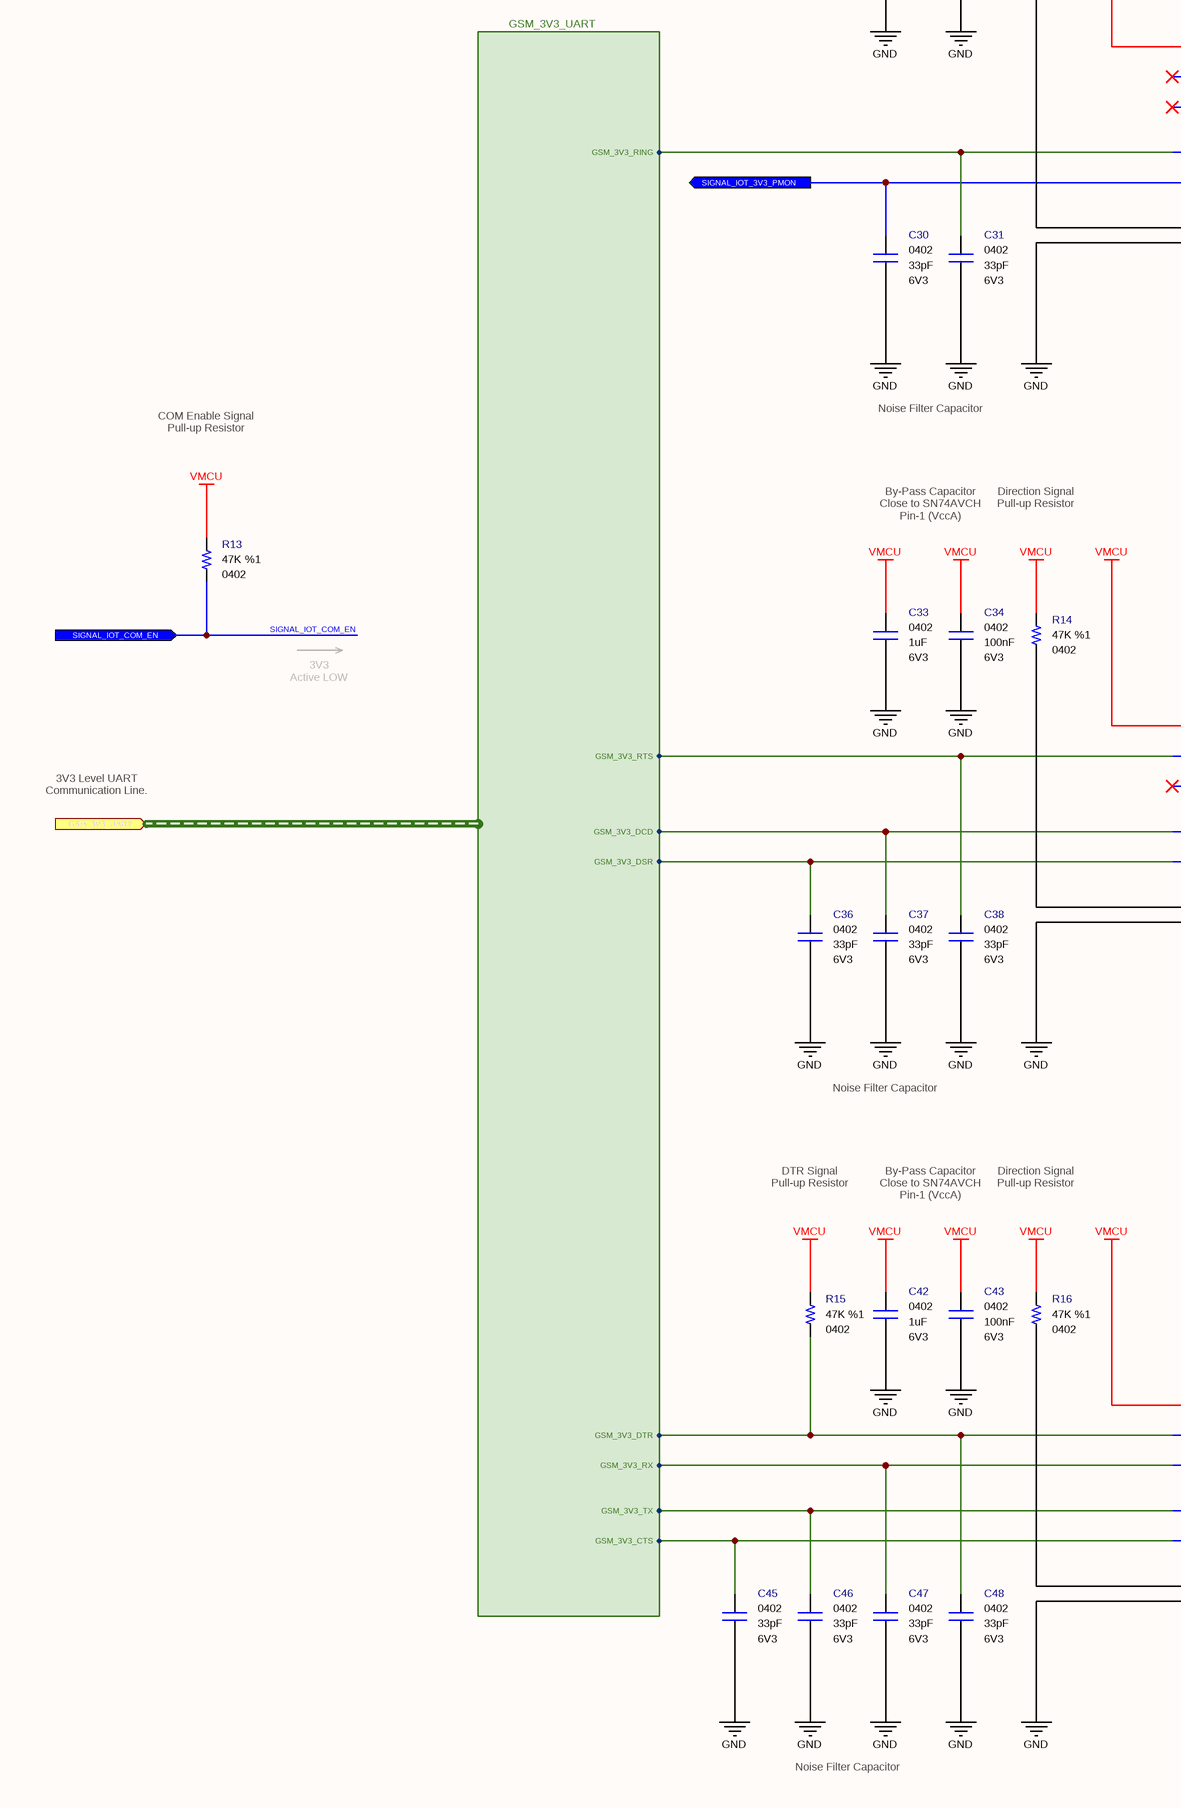
[diagram p15: Bidirectional Voltage Translator.SchDoc, bottom left]
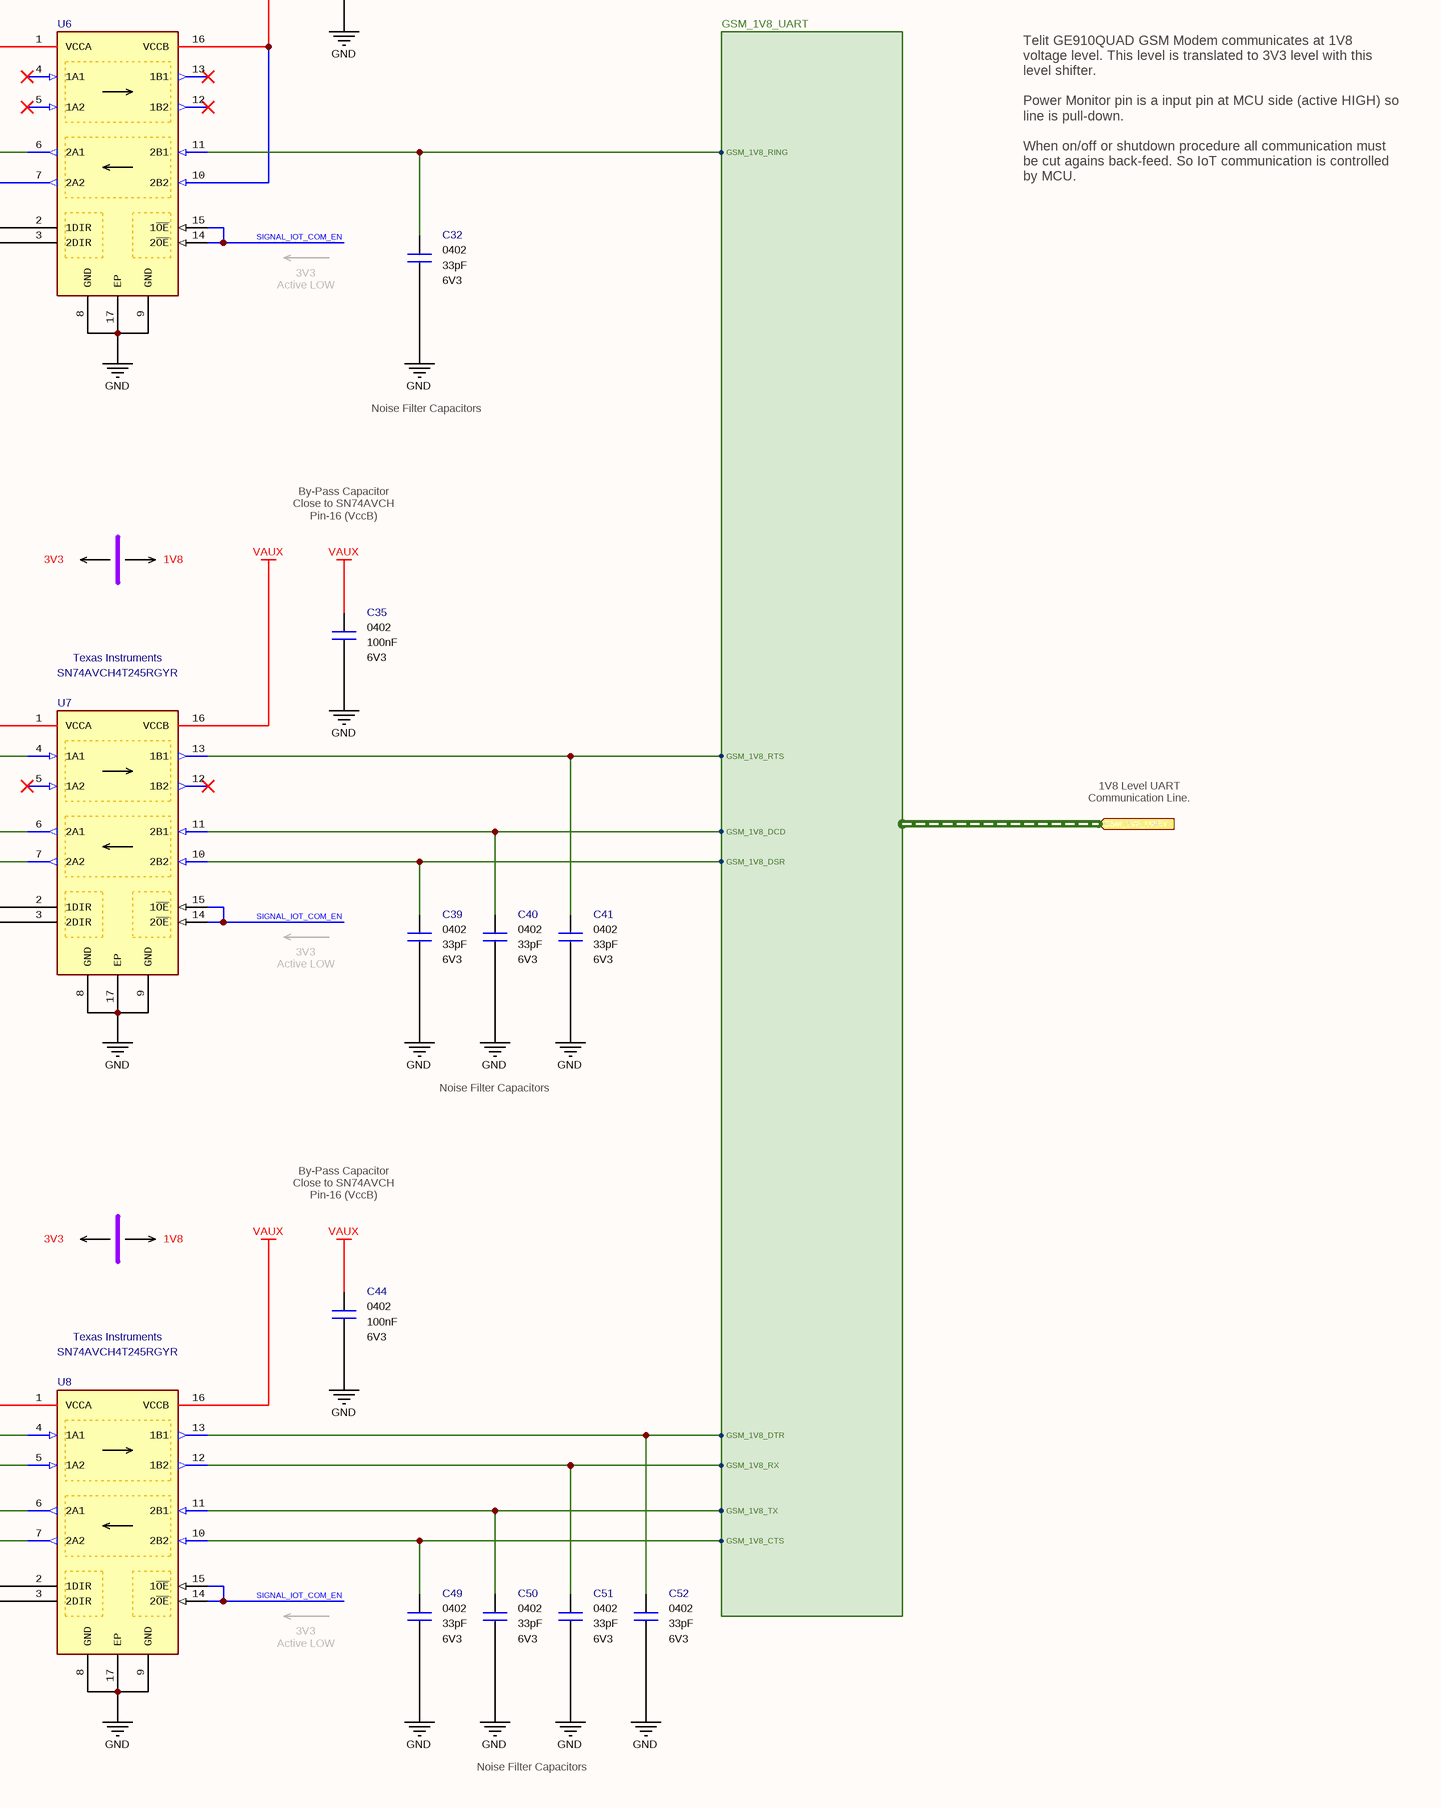
[diagram p16: Bidirectional Voltage Translator.SchDoc, bottom right]

### Parts
C27  value 1uF  Case: 0402  Voltage: 6V3  [CAPACITOR_0402]  (hidden comment: Multilayer Ceramic Capacitor)
C28  value 100nF  Case: 0402  Voltage: 6V3  [CAPACITOR_0402]  (hidden comment: Multilayer Ceramic Capacitor)
C29  value 100nF  Case: 0402  Voltage: 6V3  [CAPACITOR_0402]  (hidden comment: Multilayer Ceramic Capacitor)
C30  value 33pF  Case: 0402  Voltage: 6V3  [CAPACITOR_0402]  (hidden comment: Multilayer Ceramic Capacitor)
C31  value 33pF  Case: 0402  Voltage: 6V3  [CAPACITOR_0402]  (hidden comment: Multilayer Ceramic Capacitor)
C32  value 33pF  Case: 0402  Voltage: 6V3  [CAPACITOR_0402]  (hidden comment: Multilayer Ceramic Capacitor)
C33  value 1uF  Case: 0402  Voltage: 6V3  [CAPACITOR_0402]  (hidden comment: Multilayer Ceramic Capacitor)
C34  value 100nF  Case: 0402  Voltage: 6V3  [CAPACITOR_0402]  (hidden comment: Multilayer Ceramic Capacitor)
C35  value 100nF  Case: 0402  Voltage: 6V3  [CAPACITOR_0402]  (hidden comment: Multilayer Ceramic Capacitor)
C36  value 33pF  Case: 0402  Voltage: 6V3  [CAPACITOR_0402]  (hidden comment: Multilayer Ceramic Capacitor)
C37  value 33pF  Case: 0402  Voltage: 6V3  [CAPACITOR_0402]  (hidden comment: Multilayer Ceramic Capacitor)
C38  value 33pF  Case: 0402  Voltage: 6V3  [CAPACITOR_0402]  (hidden comment: Multilayer Ceramic Capacitor)
C39  value 33pF  Case: 0402  Voltage: 6V3  [CAPACITOR_0402]  (hidden comment: Multilayer Ceramic Capacitor)
C40  value 33pF  Case: 0402  Voltage: 6V3  [CAPACITOR_0402]  (hidden comment: Multilayer Ceramic Capacitor)
C41  value 33pF  Case: 0402  Voltage: 6V3  [CAPACITOR_0402]  (hidden comment: Multilayer Ceramic Capacitor)
C42  value 1uF  Case: 0402  Voltage: 6V3  [CAPACITOR_0402]  (hidden comment: Multilayer Ceramic Capacitor)
C43  value 100nF  Case: 0402  Voltage: 6V3  [CAPACITOR_0402]  (hidden comment: Multilayer Ceramic Capacitor)
C44  value 100nF  Case: 0402  Voltage: 6V3  [CAPACITOR_0402]  (hidden comment: Multilayer Ceramic Capacitor)
C45  value 33pF  Case: 0402  Voltage: 6V3  [CAPACITOR_0402]  (hidden comment: Multilayer Ceramic Capacitor)
C46  value 33pF  Case: 0402  Voltage: 6V3  [CAPACITOR_0402]  (hidden comment: Multilayer Ceramic Capacitor)
C47  value 33pF  Case: 0402  Voltage: 6V3  [CAPACITOR_0402]  (hidden comment: Multilayer Ceramic Capacitor)
C48  value 33pF  Case: 0402  Voltage: 6V3  [CAPACITOR_0402]  (hidden comment: Multilayer Ceramic Capacitor)
C49  value 33pF  Case: 0402  Voltage: 6V3  [CAPACITOR_0402]  (hidden comment: Multilayer Ceramic Capacitor)
C50  value 33pF  Case: 0402  Voltage: 6V3  [CAPACITOR_0402]  (hidden comment: Multilayer Ceramic Capacitor)
C51  value 33pF  Case: 0402  Voltage: 6V3  [CAPACITOR_0402]  (hidden comment: Multilayer Ceramic Capacitor)
C52  value 33pF  Case: 0402  Voltage: 6V3  [CAPACITOR_0402]  (hidden comment: Multilayer Ceramic Capacitor)
R12  value 47K  Tolerance: %1  Case: 0402  [RESISTOR_0402]  (hidden comment: 47K - 0402 - %1 - 1/16W)
R13  value 47K  Tolerance: %1  Case: 0402  [RESISTOR_0402]  (hidden comment: 47K - 0402 - %1 - 1/16W)
R14  value 47K  Tolerance: %1  Case: 0402  [RESISTOR_0402]  (hidden comment: 47K - 0402 - %1 - 1/16W)
R15  value 47K  Tolerance: %1  Case: 0402  [RESISTOR_0402]  (hidden comment: 47K - 0402 - %1 - 1/16W)
R16  value 47K  Tolerance: %1  Case: 0402  [RESISTOR_0402]  (hidden comment: 47K - 0402 - %1 - 1/16W)
U6  Manufacturer Part Number: SN74AVCH4T245RGYR  Manufacturer Name: Texas Instruments  [VQFN16]  (hidden comment: Voltage Level Shifter)
U7  Manufacturer Part Number: SN74AVCH4T245RGYR  Manufacturer Name: Texas Instruments  [VQFN16]  (hidden comment: Voltage Level Shifter)
U8  Manufacturer Part Number: SN74AVCH4T245RGYR  Manufacturer Name: Texas Instruments  [VQFN16]  (hidden comment: Voltage Level Shifter)

### Ports
GSM_1V8_UART (in, harness GSM_1V8_UART), GSM_3V3_UART (in, harness GSM_3V3_UART), SIGNAL_IOT_3V3_PMON (out), SIGNAL_IOT_COM_EN (in)

### Harnesses
GSM_3V3_UART: GSM_3V3_RX, GSM_3V3_TX, GSM_3V3_DTR, GSM_3V3_RTS, GSM_3V3_CTS, GSM_3V3_DCD, GSM_3V3_DSR, GSM_3V3_RING
GSM_1V8_UART: GSM_1V8_RX, GSM_1V8_TX, GSM_1V8_DTR, GSM_1V8_RTS, GSM_1V8_CTS, GSM_1V8_DCD, GSM_1V8_DSR, GSM_1V8_RING

### Nets
GND: C27.1 C28.1 C29.1 C30.1 C31.1 C32.1 C33.1 C34.1 C35.1 C36.1 C37.1 C38.1 C39.1 C40.1 C41.1 C42.1 C43.1 C44.1 C45.1 C46.1 C47.1 C48.1 C49.1 C50.1 C51.1 C52.1 U6.3(2DIR) U6.8(GND) U6.9(GND) U6.17(EP) U7.3(2DIR) U7.8(GND) U7.9(GND) U7.17(EP) U8.3(2DIR) U8.8(GND) U8.9(GND) U8.17(EP)
VAUX: C29.2 C35.2 C44.2 U6.10(2B2) U6.16(VCCB) U7.16(VCCB) U8.16(VCCB)
VMCU: C27.2 C28.2 C33.2 C34.2 C42.2 C43.2 R12.2 R13.2 R14.2 R15.2 R16.2 U6.1(VCCA) U7.1(VCCA) U8.1(VCCA)
GSM_3V3_UART.GSM_3V3_CTS: C45.2 U8.7(2A2) ; port GSM_3V3_UART.GSM_3V3_CTS
GSM_3V3_UART.GSM_3V3_DCD: C37.2 U7.6(2A1) ; port GSM_3V3_UART.GSM_3V3_DCD
GSM_3V3_UART.GSM_3V3_DSR: C36.2 U7.7(2A2) ; port GSM_3V3_UART.GSM_3V3_DSR
GSM_3V3_UART.GSM_3V3_DTR: C48.2 R15.1 U8.4(1A1) ; port GSM_3V3_UART.GSM_3V3_DTR
GSM_3V3_UART.GSM_3V3_RING: C31.2 U6.6(2A1) ; port GSM_3V3_UART.GSM_3V3_RING
GSM_3V3_UART.GSM_3V3_RTS: C38.2 U7.4(1A1) ; port GSM_3V3_UART.GSM_3V3_RTS
GSM_3V3_UART.GSM_3V3_RX: C47.2 U8.5(1A2) ; port GSM_3V3_UART.GSM_3V3_RX
GSM_3V3_UART.GSM_3V3_TX: C46.2 U8.6(2A1) ; port GSM_3V3_UART.GSM_3V3_TX
SIGNAL_IOT_3V3.SIGNAL_IOT_3V3_PMON: C30.2 U6.7(2A2) ; port SIGNAL_IOT_3V3_PMON
SIGNAL_IOT_COM_EN: R13.1 U6.14(2~{OE}) U6.15(1~{OE}) U7.14(2~{OE}) U7.15(1~{OE}) U8.14(2~{OE}) U8.15(1~{OE}) ; port SIGNAL_IOT_COM_EN  [project net SIGNAL_IOT_3V3.SIGNAL_IOT_COM_EN]
NetC32_2: C32.2 U6.11(2B1) ; port GSM_1V8_UART.GSM_1V8_RING
NetC39_2: C39.2 U7.10(2B2) ; port GSM_1V8_UART.GSM_1V8_DSR
NetC40_2: C40.2 U7.11(2B1) ; port GSM_1V8_UART.GSM_1V8_DCD
NetC41_2: C41.2 U7.13(1B1) ; port GSM_1V8_UART.GSM_1V8_RTS
NetC49_2: C49.2 U8.10(2B2) ; port GSM_1V8_UART.GSM_1V8_CTS
NetC50_2: C50.2 U8.11(2B1) ; port GSM_1V8_UART.GSM_1V8_TX
NetC51_2: C51.2 U8.12(1B2) ; port GSM_1V8_UART.GSM_1V8_RX
NetC52_2: C52.2 U8.13(1B1) ; port GSM_1V8_UART.GSM_1V8_DTR
NetR12_1: R12.1 U6.2(1DIR)
NetR14_1: R14.1 U7.2(1DIR)
NetR16_1: R16.1 U8.2(1DIR)

Not connected (* = marked no-connect by the designer): U6 4(1A1)* 5(1A2)* 12(1B2)* 13(1B1)*; U7 5(1A2)* 12(1B2)*

### Notes on the sheet
- BiDirectional Level Shifter
- By-Pass Capacitor
  Close to SN74AVCH
  Pin-1 (VccA)
- Direction Signal
  Pull-up Resistor
- 3V3
- 1V8
- By-Pass Capacitor
  Close to SN74AVCH
  Pin-16 (VccB)
- 3V3 Level UART Communication Line.
- 1V8 Level UART Communication Line.
- Telit GE910QUAD GSM Modem communicates at 1V8 voltage level. This level is translated to 3V3 level with this  level shifter.
  Power Monitor pin is a input pin at MCU side (active HIGH) so line is pull-down.
  When on/off or shutdown procedure all communication must be cut agains back-feed. So IoT communication is controlled by MCU.
- 3V3
  Active LOW
- Noise Filter Capacitor
- Noise Filter Capacitors
- COM Enable Signal
  Pull-up Resistor
- DTR Signal
  Pull-up Resistor
- Engineer
- Customer
- All Rights are reserved to Customer and Engineer. [2021]
- Size:
- Date:
- File:
- A2
- Project :
- Time:
- Sheet
- of
- Product ID
- Module ID
- Version
- Revision

### Library data of the parts
C27 C33 C42 = Capacitor - 1uF [0402-6V3]: Capacitor - 1uF [0402] (Ceramic); Manufacturer Name: Murata Electronics; Manufacturer Part Number: GRM153R60J105ME95D; Dielectric: X5R; Tolerance: 20%; Height: 0.3mm; Maximum Operating Temperature: +85; Minimum Operating Temperature: -55; RoHS: Yes; Weight: 6mg; ComponentLink1Description: DataSheet; ComponentLink1URL: https://psearch.en.murata.com/capacitor/product/GRM153R60J105ME95%23.html; ComponentLink2Description: Mouser; ComponentLink2URL: https://www.mouser.com/Search/Refine.aspx?Keyword=81-GRM153R60J105ME5D; Supplier 1: Future Electronics; Supplier 2: Future Electronics; Supplier 3: Mouser; Supplier 4: Arrow; Supplier 5: Digi-Key; Supplier Part Number 5: 490-14576-1-ND; Supplier Part Number 4: GRM153R60J105ME95D; Supplier Part Number 3: 81-GRM153R60J105ME5D; Supplier Part Number 2: GRM153R60J105ME95D-REEL; Supplier Part Number 1: GRM153R60J105ME95D-CUTT; Mouser Part Number: 81-GRM153R60J105ME5D
C28 C29 C34 C35 C43 C44 = Capacitor - 100nF [0402-6V3]: as C13 on sheet 3V3 LDO Regulator; Height: 0.25mm; ComponentLink1Description: Mouser; ComponentLink1URL: https://www.mouser.com.tr/ProductDetail/AVX/04026D104KAT4A?qs=sGAEpiMZZMs0AnBnWHyRQPg4iYkCw7IMED%2F4kpqgf7w%3D; ComponentLink2Description: DataSheet; ComponentLink2URL: https://www.mouser.com.tr/datasheet/2/40/cx5r-776519.pdf; ROHS: Yes; Maximum Operating Temperature: +85; Minimum Operating Temperature: -55; Supplier 1: Avnet; Supplier Part Number 1: 04026D104KAT4A; Mouser Part Number: 581-04026D104KAT4A
C30-C32 C36-C41 C45-C52 = Capacitor - 33pF [0402-6V3]: as C222 on sheet 3V8 Buck Boost Converter; Height: 0.5mm; Maximum Operating Temperature: +125; Minimum Operating Temperature: -55; ROHS: Yes; ComponentLink1Description: DataSheet; ComponentLink1URL: https://api.kemet.com/component-edge/download/datasheet/C0402C330J9RACAUTO.pdf; ComponentLink2Description: Mouser; ComponentLink2URL: https://www.mouser.com/Search/Refine.aspx?Keyword=80-C0402C330J9RAUTO; Supplier 1: Mouser; Supplier Part Number 1: 80-C0402C330J9RAUTO; Mouser Part Number: 80-C0402C330J9RAUTO
R12-R16 = Resistor - 47K: as R69 on sheet 5V Buck Boost Converter; Height: 0.4mm; ComponentLink1Description: DataSheet; ComponentLink1URL: https://www.mouser.com.tr/datasheet/2/427/dcrcwe3-1762152.pdf; ComponentLink2Description: Mouser; ComponentLink2URL: https://www.mouser.com.tr/ProductDetail/Vishay-Dale/CRCW040247K0FKED?qs=sGAEpiMZZMu61qfTUdNhG2DpbjADlD3GL%252B3h1elTxqU%3D; Supplier 1: RSComponents; Supplier 2: Newark; Supplier Part Number 1: 6789361P; Supplier Part Number 2: 52K7097; Supplier 3: Avnet; Supplier 4: RSComponents; Supplier 5: Future Electronics; Supplier 6: Future Electronics; Supplier 7: Newark; Supplier 8: Arrow Electronics; Supplier 9: Mouser; Supplier 10: Newark; Supplier 11: Avnet; Supplier 12: Digi-Key; Supplier 13: Digi-Key; Supplier 14: Digi-Key; Supplier 15: Newark; Supplier 16: Farnell; Supplier 17: Farnell; Supplier 18: Farnell; Supplier 19: Allied Electronics; Supplier 20: Allied Electronics; Supplier 21: Avnet; Supplier 22: Future Electronics; Supplier 23: Future Electronics; Supplier 24: Future Electronics; Supplier 25: Newark; Supplier 26: RSComponents; Supplier 27: RSComponents; Supplier Part Number 3: 52K7097; Supplier Part Number 4: 6789361; Supplier Part Number 5: 2103738; Supplier Part Number 6: 7521222; Supplier Part Number 7: 42K3500; Supplier Part Number 8: CRCW040247K0FKED; Supplier Part Number 12: 541-47.0KLCT-ND; Supplier Part Number 14: 541-47.0KLTR-ND; Supplier Part Number 10: 61M5310; Supplier Part Number 9: 71-CRCW0402-47K-E3; Supplier Part Number 13: 541-47.0KLDKR-ND; Supplier Part Number 11: CRCW040247K0FKED; Supplier Part Number 15: 25AC7165; Supplier Part Number 16: 1469719; Supplier Part Number 18: 2121814; Supplier Part Number 17: 1469719RL; Supplier Part Number 19: 70202660; Supplier Part Number 20: 70272767; Supplier Part Number 21: 42K3500; Supplier Part Number 22: 6128776; Supplier Part Number 24: CRCW040247K0FKED-REEL; Supplier Part Number 23: CRCW040247K0FKED-CUTT; Supplier Part Number 25: 24W2315; Supplier Part Number 26: 1688455; Supplier Part Number 27: 1823505
U6-U8 = IC - SN74AVCH4T245: Translation - Voltage Levels Low Power Dual Channel; Supply Voltage - Max: 3.6V; Supply Voltage - Min: 1.2V; Height: 1mm; ComponentLink1Description: DataSheet; ComponentLink1URL: http://www.ti.com/general/docs/suppproductinfo.tsp?distId=26&gotoUrl=http%3A%2F%2Fwww.ti.com%2Flit%2Fgpn%2Fsn74avch4t245; Maximum Operating Temperature: +85; Minimum Operating Temperature: -40; ComponentLink2Description: Mouser; ComponentLink2URL: https://www.mouser.com.tr/ProductDetail/Texas-Instruments/SN74AVCH4T245RGYR?qs=PVVDbbWpW3IMTHF1QV2g%252BQ==; Supplier 1: Mouser; Supplier 2: Arrow; Supplier 3: Digi-Key; Supplier Part Number 1: 595-SN74AVCH4T245RGY; Supplier Part Number 2: SN74AVCH4T245RGYR; Supplier Part Number 3: 296-18262-1-ND; Case: VQFN-16; Mouser Part Number: 595-SN74AVCH4T245RGY

## Sheet GSM LED Indicators.SchDoc: GSM Modem Signal Indicator LED's
size A3; ApprovedBy: Mehmet Günce Akkoyun; CheckedBy: Mehmet Günce Akkoyun; Author: Mehmet Günce Akkoyun; CompanyName: Ovoo Electronics; DrawnBy: Mehmet Günce Akkoyun; Engineer: Mehmet Günce Akkoyun; Organization: Ovoo Electronics; Address1: Necip Fazıl Mah. Ortaırmak Sok.; Address2: Birgül Apt. No: 19/6; Address3: Meram / Konya; Address4: Turkiye; DocumentNumber: 12; Revision: R06; SheetNumber: 12; SheetTotal: 54
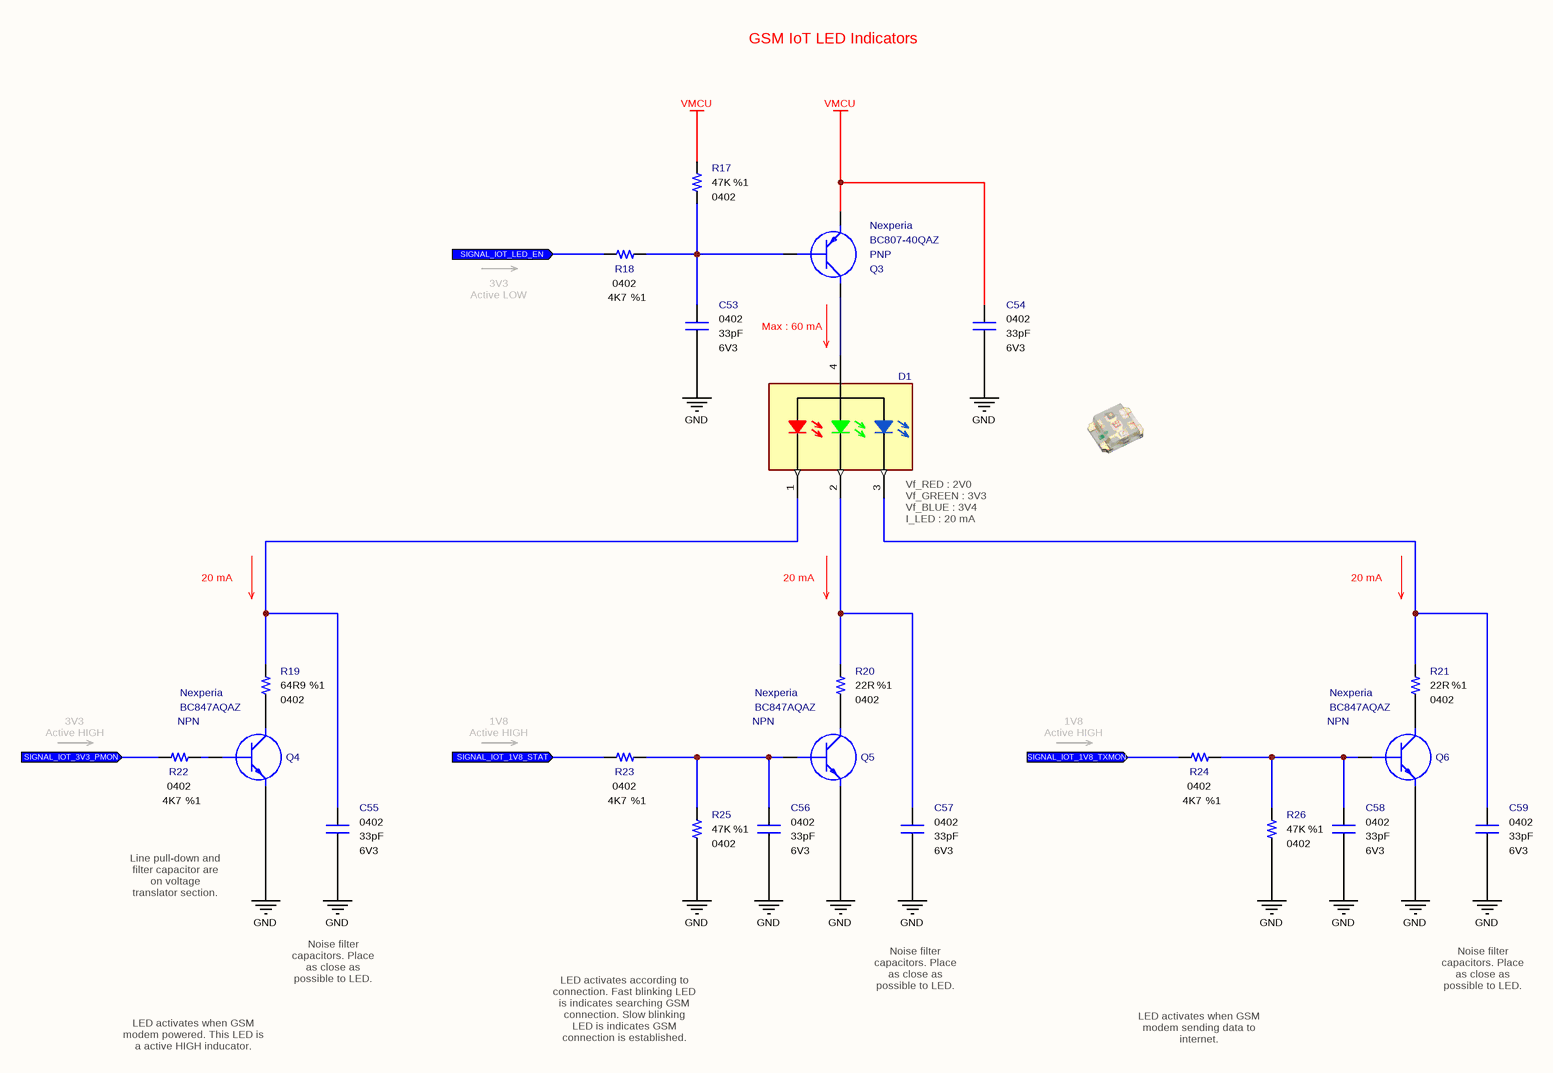
[diagram p17: GSM LED Indicators.SchDoc]

### Parts
C53  value 33pF  Case: 0402  Voltage: 6V3  [CAPACITOR_0402]  (hidden comment: Multilayer Ceramic Capacitor)
C54  value 33pF  Case: 0402  Voltage: 6V3  [CAPACITOR_0402]  (hidden comment: Multilayer Ceramic Capacitor)
C55  value 33pF  Case: 0402  Voltage: 6V3  [CAPACITOR_0402]  (hidden comment: Multilayer Ceramic Capacitor)
C56  value 33pF  Case: 0402  Voltage: 6V3  [CAPACITOR_0402]  (hidden comment: Multilayer Ceramic Capacitor)
C57  value 33pF  Case: 0402  Voltage: 6V3  [CAPACITOR_0402]  (hidden comment: Multilayer Ceramic Capacitor)
C58  value 33pF  Case: 0402  Voltage: 6V3  [CAPACITOR_0402]  (hidden comment: Multilayer Ceramic Capacitor)
C59  value 33pF  Case: 0402  Voltage: 6V3  [CAPACITOR_0402]  (hidden comment: Multilayer Ceramic Capacitor)
D1  150066M153000  [Wurth_0606]  (value not drawn)
Q3  Polarity: PNP  Manufacturer Name: Nexperia  Manufacturer Part Number: BC807-40QAZ  [SOT1215]  (hidden comment: Bipolar PNP Transistors)
Q4  Polarity: NPN  Manufacturer Name: Nexperia  [SOT1215]  (hidden comment: BC847AQAZ)
Q5  Polarity: NPN  Manufacturer Name: Nexperia  [SOT1215]  (hidden comment: BC847AQAZ)
Q6  Polarity: NPN  Manufacturer Name: Nexperia  [SOT1215]  (hidden comment: BC847AQAZ)
R17  value 47K  Tolerance: %1  Case: 0402  [RESISTOR_0402]  (hidden comment: 47K - 0402 - %1 - 1/16W)
R18  value 4K7  Tolerance: %1  Case: 0402  [RESISTOR_0402]  (hidden comment: Thick Film Resistor)
R19  value 64R9  Tolerance: %1  Case: 0402  [RESISTOR_0402]  (hidden comment: Thick Film Resistor)
R20  value 22R  Tolerance: %1  Case: 0402  [RESISTOR_0402]  (hidden comment: Thick Film Resistor)
R21  value 22R  Tolerance: %1  Case: 0402  [RESISTOR_0402]  (hidden comment: Thick Film Resistor)
R22  value 4K7  Tolerance: %1  Case: 0402  [RESISTOR_0402]  (hidden comment: Thick Film Resistor)
R23  value 4K7  Tolerance: %1  Case: 0402  [RESISTOR_0402]  (hidden comment: Thick Film Resistor)
R24  value 4K7  Tolerance: %1  Case: 0402  [RESISTOR_0402]  (hidden comment: Thick Film Resistor)
R25  value 47K  Tolerance: %1  Case: 0402  [RESISTOR_0402]  (hidden comment: 47K - 0402 - %1 - 1/16W)
R26  value 47K  Tolerance: %1  Case: 0402  [RESISTOR_0402]  (hidden comment: 47K - 0402 - %1 - 1/16W)

### Ports
SIGNAL_IOT_1V8_STAT (in), SIGNAL_IOT_1V8_TXMON (in), SIGNAL_IOT_3V3_PMON (in), SIGNAL_IOT_LED_EN (in)

### Nets
GND: C53.2 C54.2 C55.2 C56.2 C57.2 C58.2 C59.2 Q4.2(E) Q5.2(E) Q6.2(E) R25.1 R26.1
VMCU: C54.1 Q3.2(E) R17.2
SIGNAL_IOT_3V3.SIGNAL_IOT_3V3_PMON: R22.2 ; port SIGNAL_IOT_3V3_PMON
SIGNAL_IOT_3V3.SIGNAL_IOT_LED_EN: R18.2 ; port SIGNAL_IOT_LED_EN
NetC53_1: C53.1 Q3.1(B) R17.1 R18.1
NetC55_1: C55.1 D1.1 R19.2
NetC56_1: C56.1 Q5.1(B) R23.1 R25.2
NetC57_1: C57.1 D1.2 R20.2
NetC58_1: C58.1 Q6.1(B) R24.1 R26.2
NetC59_1: C59.1 D1.3 R21.2
NetD1_4: D1.4 Q3.3(C)
NetQ4_1: Q4.1(B) R22.1
NetQ4_3: Q4.3(C) R19.1
NetQ5_3: Q5.3(C) R20.1
NetQ6_3: Q6.3(C) R21.1
NetR23_2: R23.2 ; port SIGNAL_IOT_1V8_STAT
NetR24_2: R24.2 ; port SIGNAL_IOT_1V8_TXMON

### Notes on the sheet
- GSM IoT LED Indicators
- 3V3
  Active LOW
- Max : 60 mA
- (near D1) Vf_RED : 2V0
  Vf_GREEN : 3V3
  Vf_BLUE : 3V4
  I_LED : 20 mA
- 20 mA
- 3V3
  Active HIGH
- 1V8
  Active HIGH
- Line pull-down and filter capacitor are on voltage translator section.
- Noise filter capacitors. Place as close as possible to LED.
- LED activates when GSM modem powered. This LED is a active HIGH inducator.
- LED activates according to connection. Fast blinking LED is indicates searching GSM connection. Slow blinking LED is indicates GSM connection is established.
- LED activates when GSM modem sending data to internet.
- Engineer
- All Rights are reserved to Customer and Engineer. [2021]
- Size:
- Date:
- A3
- Project :
- Time:
- Sheet
- of
- Customer
- Product ID
- Module ID
- Version
- File:
- Revision

### Library data of the parts
C53-C59 = Capacitor - 33pF [0402-6V3]: Capacitor - 33pF [0402] (Ceramic); Manufacturer Name: Kemet; Manufacturer Part Number: C0402C330J9RACAUTO; Dielectric: X7R; Tolerance: 10%; Height: 0.5mm; Maximum Operating Temperature: +125; Minimum Operating Temperature: -55; ROHS: Yes; ComponentLink1Description: DataSheet; ComponentLink1URL: https://api.kemet.com/component-edge/download/datasheet/C0402C330J9RACAUTO.pdf; ComponentLink2Description: Mouser; ComponentLink2URL: https://www.mouser.com/Search/Refine.aspx?Keyword=80-C0402C330J9RAUTO; Supplier 1: Mouser; Supplier Part Number 1: 80-C0402C330J9RAUTO; Mouser Part Number: 80-C0402C330J9RAUTO
D1 = Diode - RGB LED (150066M153000): Standard LEDs - SMD PICOLED series Red LED; Manufacturer Name: Wurth Elektronik; Datasheet Link: https://www.mouser.com.tr/datasheet/2/445/150066M153000-1715259.pdf; Manufacturer Part Number: 150066M153000; Mouser Part Number: 710-150066M153000; Mouser Price/Stock: https://www.mouser.com.tr/ProductDetail/ROHM-Semiconductor/SML-P12U2TT86R?qs=sGAEpiMZZMseGfSY3csMkRIBDsfU3UCXJTULB5gem9Ta%252Bp%252BvZ709fg%3D%3D; Case: 0606; ROHS: Yes; Supplier 1: RSComponents; Supplier 2: RSComponents; Supplier 3: Mouser; Supplier 4: Farnell; Supplier 5: Digi-Key; Supplier 6: Digi-Key; Supplier 7: Digi-Key; Supplier 8: Newark; Supplier Part Number 1: 1765006; Supplier Part Number 2: 1766050; Supplier Part Number 3: 710-150066M153000; Supplier Part Number 4: 2764964; Supplier Part Number 5: 732-11390-1-ND; Supplier Part Number 6: 732-11390-6-ND; Supplier Part Number 7: 732-11390-2-ND; Supplier Part Number 8: 22AC3253
Q3 = Transistor - BC807: Bipolar Transistors - BJT 45 V, 500 mA PNP gen purpose transistors; Mouser Part Number: 771-BC807-40QAZ; ComponentLink1Description: DataSheet; ComponentLink1URL: https://www.mouser.com.tr/datasheet/2/916/BC807-25QA_40QA-1665956.pdf; ComponentLink2Description: Mouser; ComponentLink2URL: https://www.mouser.com.tr/ProductDetail/Nexperia/BC807-40QAZ?qs=sGAEpiMZZMshyDBzk1%2FWi8mfWMj7sMzapbI3Mu1S6AqR9y7krhZTdA%3D%3D; Supplier 1: Mouser; Supplier 2: Arrow; Supplier 3: Digi-Key; Supplier 4: Digi-Key; Supplier Part Number 1: 771-BC807-40QAZ; Supplier Part Number 2: BC807-40QAZ; Supplier Part Number 3: 1727-2242-1-ND; Supplier Part Number 4: 1727-2242-6-ND; Case: DFN-1010D-3
Q4-Q6 = Transistor - BC847: Bipolar NPN Transistors; Case: DFN-1010D-3; Supplier 1: Digi-Key; Supplier 2: Digi-Key; Supplier Part Number 1: 1727-2545-1-ND; Supplier Part Number 2: 1727-2545-6-ND; Manufacturer Part Number: BC847AQAZ; Supplier 3: Avnet; Supplier 4: Arrow Electronics; Supplier 5: Mouser; Supplier 6: Newark; Supplier 7: Digi-Key; Supplier 8: Farnell; Supplier 9: Farnell; Supplier Part Number 3: BC847AQAZ; Supplier Part Number 4: BC847AQAZ; Supplier Part Number 5: 771-BC847AQAZ; Supplier Part Number 6: 82Y6125; Supplier Part Number 7: 1727-2545-2-ND; Supplier Part Number 8: 2545344; Supplier Part Number 9: 2545344RL
R17 R25 R26 = Resistor - 47K: Thick Film Resistors - SMD 1/16 W 47 Kohms 1%; Manufacturer Name: Vishay; Manufacturer Part Number: CRCW040247K0FKED; Height: 0.4mm; ComponentLink1Description: DataSheet; ComponentLink1URL: https://www.mouser.com.tr/datasheet/2/427/dcrcwe3-1762152.pdf; ComponentLink2Description: Mouser; ComponentLink2URL: https://www.mouser.com.tr/ProductDetail/Vishay-Dale/CRCW040247K0FKED?qs=sGAEpiMZZMu61qfTUdNhG2DpbjADlD3GL%252B3h1elTxqU%3D; Supplier 1: RSComponents; Supplier 2: Newark; Supplier Part Number 1: 6789361P; Supplier Part Number 2: 52K7097; Supplier 3: Avnet; Supplier 4: RSComponents; Supplier 5: Future Electronics; Supplier 6: Future Electronics; Supplier 7: Newark; Supplier 8: Arrow Electronics; Supplier 9: Mouser; Supplier 10: Newark; Supplier 11: Avnet; Supplier 12: Digi-Key; Supplier 13: Digi-Key; Supplier 14: Digi-Key; Supplier 15: Newark; Supplier 16: Farnell; Supplier 17: Farnell; Supplier 18: Farnell; Supplier 19: Allied Electronics; Supplier 20: Allied Electronics; Supplier 21: Avnet; Supplier 22: Future Electronics; Supplier 23: Future Electronics; Supplier 24: Future Electronics; Supplier 25: Newark; Supplier 26: RSComponents; Supplier 27: RSComponents; Supplier Part Number 3: 52K7097; Supplier Part Number 4: 6789361; Supplier Part Number 5: 2103738; Supplier Part Number 6: 7521222; Supplier Part Number 7: 42K3500; Supplier Part Number 8: CRCW040247K0FKED; Supplier Part Number 12: 541-47.0KLCT-ND; Supplier Part Number 14: 541-47.0KLTR-ND; Supplier Part Number 10: 61M5310; Supplier Part Number 9: 71-CRCW0402-47K-E3; Supplier Part Number 13: 541-47.0KLDKR-ND; Supplier Part Number 11: CRCW040247K0FKED; Supplier Part Number 15: 25AC7165; Supplier Part Number 16: 1469719; Supplier Part Number 18: 2121814; Supplier Part Number 17: 1469719RL; Supplier Part Number 19: 70202660; Supplier Part Number 20: 70272767; Supplier Part Number 21: 42K3500; Supplier Part Number 22: 6128776; Supplier Part Number 24: CRCW040247K0FKED-REEL; Supplier Part Number 23: CRCW040247K0FKED-CUTT; Supplier Part Number 25: 24W2315; Supplier Part Number 26: 1688455; Supplier Part Number 27: 1823505
R18 R22-R24 = Resistor - 4K7: Thick Film Resistors - SMD 1/16 W 4.7 Kohms 1%; Manufacturer Name: Vishay; Manufacturer Part Number: CRCW04024K70FKED; Height: 0.4mm; Mouser Part Number: 71-CRCW0402-4.7K-E3; ComponentLink1Description: DataSheet; ComponentLink1URL: https://www.mouser.com.tr/datasheet/2/427/dcrcwe3-1762152.pdf; ComponentLink2Description: Mouser; ComponentLink2URL: https://www.mouser.com.tr/ProductDetail/Vishay-Dale/CRCW04024K70FKED?qs=sGAEpiMZZMu61qfTUdNhG7nHf%2F6MTUn3HadIdDQu24Q%3D; Supplier 1: Mouser; Supplier 2: Digi-Key; Supplier Part Number 2: 541-4.70KLCT-ND; Supplier Part Number 1: 71-CRCW0402-4.7K-E3
R19 = Resistor - 64R9: Thick Film Resistors - SMD 1/16 W 64R9 Ohms 1%; Manufacturer Name: Vishay; Manufacturer Part Number: CRCW040264R9FKED; Height: 0.35mm; Mouser Part Number: 71-CRCW0402-64.9-E3; ComponentLink1Description: DataSheet; ComponentLink1URL: https://www.mouser.com.tr/datasheet/2/427/dcrcwe3-1762152.pdf; ComponentLink2Description: Mouser; ComponentLink2URL: https://www.mouser.com.tr/ProductDetail/Vishay-Dale/CRCW040264R9FKED/?qs=DKbL89i6OErClCPxVYdf6Q%3D%3D; Supplier 1: Future Electronics; Supplier 2: Future Electronics; Supplier 3: Mouser; Supplier 4: Farnell; Supplier 5: Digi-Key; Supplier 6: Digi-Key; Supplier 7: Digi-Key; Supplier 8: Newark; Supplier Part Number 1: 8103763; Supplier Part Number 2: 5785985; Supplier Part Number 3: 71-CRCW0402-64.9-E3; Supplier Part Number 4: 2140657; Supplier Part Number 5: 541-64.9LCT-ND; Supplier Part Number 6: 541-64.9LDKR-ND; Supplier Part Number 7: 541-64.9LTR-ND; Supplier Part Number 8: 27W4015
R20 R21 = Resistor - 22R: Thick Film Resistors - SMD 1/16 W 22R Ohms 1%; Manufacturer Name: Vishay; Manufacturer Part Number: CRCW040222R0FKED; Height: 0.35mm; Mouser Part Number: 71-CRCW0402-22-E3; ComponentLink1Description: DataSheet; ComponentLink1URL: https://www.mouser.com.tr/datasheet/2/427/dcrcwe3-1762152.pdf; ComponentLink2Description: Mouser; ComponentLink2URL: https://www.mouser.com.tr/ProductDetail/Vishay-Dale/CRCW040264R9FKED/?qs=DKbL89i6OErClCPxVYdf6Q%3D%3D; Supplier 1: RSComponents; Supplier 2: Avnet; Supplier 3: RSComponents; Supplier 4: Future Electronics; Supplier 5: Arrow Electronics; Supplier Part Number 1: 6788983; Supplier Part Number 2: 52K6847; Supplier Part Number 3: 6788983P; Supplier Part Number 4: 3103732; Supplier Part Number 5: CRCW040222R0FKED